# Altium project fast-open-switch r1.0.PrjPcb (part 4 of 8)

## Sheet Raspberry Pi CM4.SchDoc
size A3; SheetNumber: 7; SheetTotal: 22
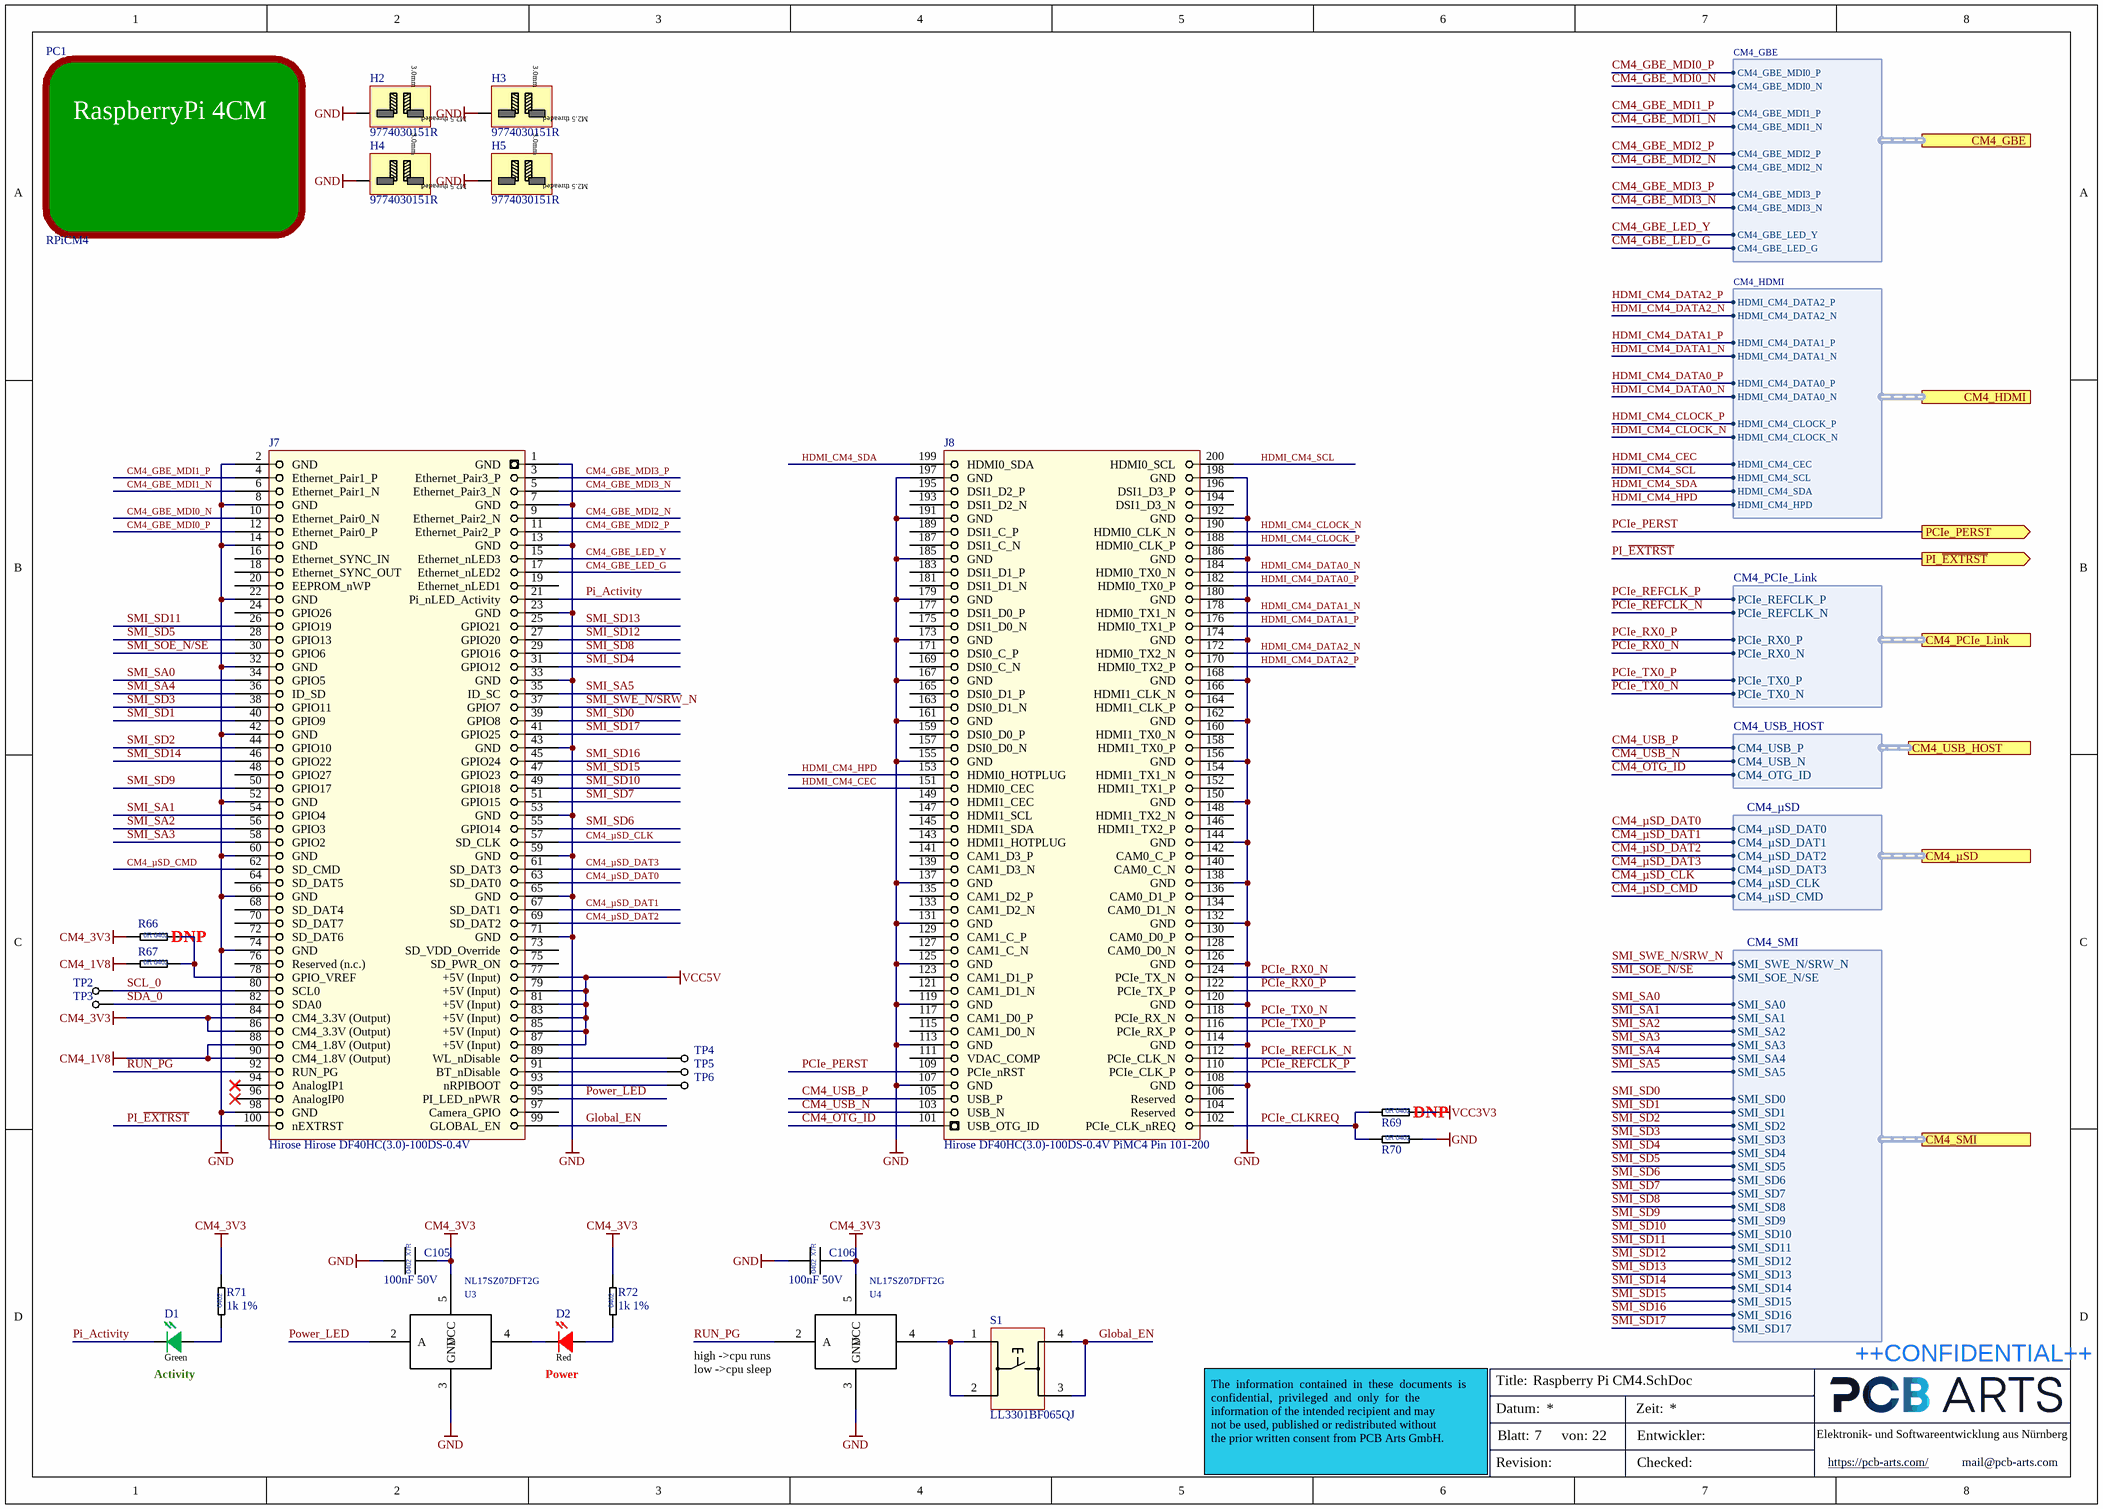
[diagram p9: Raspberry Pi CM4.SchDoc]

### Parts
C105  100nF 50V  [CAP_0402_L]
C106  100nF 50V  [CAP_0402_L]
D1  Color: Green  [LED-0603 Sideview]  (hidden comment: LTST-S270KGKT)
D2  Color: Red  [LED-0603 Sideview]  (hidden comment: LTST-S270KRKT)
H2  9774030151R  [9774030151R]
H3  9774030151R  [9774030151R]
H4  9774030151R  [9774030151R]
H5  9774030151R  [9774030151R]
J7  Hirose Hirose DF40HC(3.0)-100DS-0.4V  [Hirose DF40HC(3.0)-100DS-0.4V_1-100]
J8  Hirose DF40HC(3.0)-100DS-0.4V PiMC4 Pin 101-200  [Hirose DF40HC(3.0)-100DS-0.4V_101-200]
PC1  RPiCM4  [RaspberryPi_CM4]
R66  0R Jumper  [RES_0402_L]  (value not drawn)  (no BOM)
R67  0R Jumper  [RES_0402_L]  (value not drawn)
R69  0R Jumper  [RES_0402_L]  (value not drawn)  (no BOM)
R70  0R Jumper  [RES_0402_L]  (value not drawn)
R71  1k 1%  [RES_0402_L]
R72  1k 1%  [RES_0402_L]
S1  LL3301BF065QJ  [LL3301BF065QJ]
TP2  Testpoint  [Testpoint 0.8mm]  (value not drawn)  (no BOM)
TP3  Testpoint  [Testpoint 0.8mm]  (value not drawn)  (no BOM)
TP4  Testpoint  [Testpoint 0.8mm]  (value not drawn)  (no BOM)
TP5  Testpoint  [Testpoint 0.8mm]  (value not drawn)  (no BOM)
TP6  Testpoint  [Testpoint 0.8mm]  (value not drawn)  (no BOM)
U3  NL17SZ07DFT2G  [SOT65P210X110-5N]
U4  NL17SZ07DFT2G  [SOT65P210X110-5N]

### Ports
CM4_GBE (harness CM4_GBE, see Top-Level-Sheet[4C], Raspberry Pi CM4_Periphery[1A]), CM4_HDMI (harness CM4_HDMI, see Top-Level-Sheet[4C], Raspberry Pi CM4_Periphery[1C]), CM4_PCIe_Link (harness CM4_PCIe_Link, see Top-Level-Sheet[5C], MGT Banks 115-116[8B]), CM4_SMI (harness CM4_SMI, see Top-Level-Sheet[4C], SMI Bank 12[1A]), CM4_USB_HOST (harness CM4_USB_HOST, see Top-Level-Sheet[4C], USB-HUB-MUX[1A]), CM4_µSD (harness CM4_µSD, see Top-Level-Sheet[4C], Raspberry Pi CM4_Periphery[1D]), PCIe_PERST (out, see Top-Level-Sheet[5C], Bank 13_Bank 15_Bank 16[8A]), PI_~{EXTRST} (out, see Top-Level-Sheet[5C], Bank 13_Bank 15_Bank 16[8A])

### Harnesses
CM4_GBE: CM4_GBE_MDI0_P, CM4_GBE_MDI0_N, CM4_GBE_MDI1_P, CM4_GBE_MDI1_N, CM4_GBE_MDI2_P, CM4_GBE_MDI2_N, CM4_GBE_MDI3_P, CM4_GBE_MDI3_N, CM4_GBE_LED_Y, CM4_GBE_LED_G
CM4_HDMI: HDMI_CM4_DATA2_P, HDMI_CM4_DATA2_N, HDMI_CM4_DATA1_P, HDMI_CM4_DATA1_N, HDMI_CM4_DATA0_P, HDMI_CM4_DATA0_N, HDMI_CM4_CLOCK_P, HDMI_CM4_CLOCK_N, HDMI_CM4_CEC, HDMI_CM4_SCL, HDMI_CM4_SDA, HDMI_CM4_HPD
CM4_PCIe_Link: PCIe_REFCLK_P, PCIe_REFCLK_N, PCIe_RX0_P, PCIe_RX0_N, PCIe_TX0_P, PCIe_TX0_N
CM4_USB_HOST: CM4_USB_P, CM4_USB_N, CM4_OTG_ID
CM4_µSD: CM4_µSD_DAT1, CM4_µSD_DAT2, CM4_µSD_DAT3, CM4_µSD_CLK, CM4_µSD_DAT0, CM4_µSD_CMD
CM4_SMI: SMI_SOE_N/SE, SMI_SA0, SMI_SD0, SMI_SWE_N/SRW_N, SMI_SA1, SMI_SA2, SMI_SA3, SMI_SA4, SMI_SA5, SMI_SD1, SMI_SD2, SMI_SD3, SMI_SD4, SMI_SD5, SMI_SD6, SMI_SD7, SMI_SD8, SMI_SD9, SMI_SD10, SMI_SD11, SMI_SD12, SMI_SD13, SMI_SD14, SMI_SD15, SMI_SD16, SMI_SD17

### Nets
CM4_1V8: J7.88(CM4_1.8V_(Output)) J7.90(CM4_1.8V_(Output)) R67.1
CM4_3V3: C105.2 C106.2 J7.84(CM4_3.3V_(Output)) J7.86(CM4_3.3V_(Output)) R66.1 R71.2 R72.2 U3.5(VCC) U4.5(VCC)
GND: C105.1 C106.1 H2.1 H3.1 H4.1 H5.1 J7.1(GND) J7.2(GND) J7.7(GND) J7.8(GND) J7.13(GND) J7.14(GND) J7.22(GND) J7.23(GND) J7.32(GND) J7.33(GND) J7.42(GND) J7.43(GND) J7.52(GND) J7.53(GND) J7.59(GND) J7.60(GND) J7.65(GND) J7.66(GND) J7.71(GND) J7.74(GND) J7.98(GND) J8.107(GND) J8.108(GND) J8.113(GND) J8.114(GND) J8.119(GND) J8.120(GND) J8.125(GND) J8.126(GND) J8.131(GND) J8.132(GND) J8.137(GND) J8.138(GND) J8.144(GND) J8.150(GND) J8.155(GND) J8.156(GND) J8.161(GND) J8.162(GND) J8.167(GND) J8.168(GND) J8.173(GND) J8.174(GND) J8.179(GND) J8.180(GND) J8.185(GND) J8.186(GND) J8.191(GND) J8.192(GND) J8.197(GND) J8.198(GND) R70.2 U3.3(GND) U4.3(GND)
VCC3V3: R69.2
VCC5V: J7.77(+5V_(Input)) J7.79(+5V_(Input)) J7.81(+5V_(Input)) J7.83(+5V_(Input)) J7.85(+5V_(Input)) J7.87(+5V_(Input))
CM4_GBE_LED_G: J7.17(Ethernet_nLED2) ; port CM4_GBE.CM4_GBE_LED_G
CM4_GBE_LED_Y: J7.15(Ethernet_nLED3) ; port CM4_GBE.CM4_GBE_LED_Y
CM4_GBE_MDI0_N: J7.10(Ethernet_Pair0_N) ; port CM4_GBE.CM4_GBE_MDI0_N
CM4_GBE_MDI0_P: J7.12(Ethernet_Pair0_P) ; port CM4_GBE.CM4_GBE_MDI0_P
CM4_GBE_MDI1_N: J7.6(Ethernet_Pair1_N) ; port CM4_GBE.CM4_GBE_MDI1_N
CM4_GBE_MDI1_P: J7.4(Ethernet_Pair1_P) ; port CM4_GBE.CM4_GBE_MDI1_P
CM4_GBE_MDI2_N: J7.9(Ethernet_Pair2_N) ; port CM4_GBE.CM4_GBE_MDI2_N
CM4_GBE_MDI2_P: J7.11(Ethernet_Pair2_P) ; port CM4_GBE.CM4_GBE_MDI2_P
CM4_GBE_MDI3_N: J7.5(Ethernet_Pair3_N) ; port CM4_GBE.CM4_GBE_MDI3_N
CM4_GBE_MDI3_P: J7.3(Ethernet_Pair3_P) ; port CM4_GBE.CM4_GBE_MDI3_P
CM4_OTG_ID: J8.101(USB_OTG_ID) ; port CM4_USB_HOST.CM4_OTG_ID
CM4_USB_N: J8.103(USB_N) ; port CM4_USB_HOST.CM4_USB_N
CM4_USB_P: J8.105(USB_P) ; port CM4_USB_HOST.CM4_USB_P
CM4_µSD_CLK: J7.57(SD_CLK) ; port CM4_µSD.CM4_µSD_CLK
CM4_µSD_CMD: J7.62(SD_CMD) ; port CM4_µSD.CM4_µSD_CMD
CM4_µSD_DAT0: J7.63(SD_DAT0) ; port CM4_µSD.CM4_µSD_DAT0
CM4_µSD_DAT1: J7.67(SD_DAT1) ; port CM4_µSD.CM4_µSD_DAT1
CM4_µSD_DAT2: J7.69(SD_DAT2) ; port CM4_µSD.CM4_µSD_DAT2
CM4_µSD_DAT3: J7.61(SD_DAT3) ; port CM4_µSD.CM4_µSD_DAT3
Global_EN: J7.99(GLOBAL_EN) S1.3 S1.4
HDMI_CM4_CEC: J8.151(HDMI0_CEC) ; port CM4_HDMI.HDMI_CM4_CEC
HDMI_CM4_CLOCK_N: J8.190(HDMI0_CLK_N) ; port CM4_HDMI.HDMI_CM4_CLOCK_N
HDMI_CM4_CLOCK_P: J8.188(HDMI0_CLK_P) ; port CM4_HDMI.HDMI_CM4_CLOCK_P
HDMI_CM4_DATA0_N: J8.184(HDMI0_TX0_N) ; port CM4_HDMI.HDMI_CM4_DATA0_N
HDMI_CM4_DATA0_P: J8.182(HDMI0_TX0_P) ; port CM4_HDMI.HDMI_CM4_DATA0_P
HDMI_CM4_DATA1_N: J8.178(HDMI0_TX1_N) ; port CM4_HDMI.HDMI_CM4_DATA1_N
HDMI_CM4_DATA1_P: J8.176(HDMI0_TX1_P) ; port CM4_HDMI.HDMI_CM4_DATA1_P
HDMI_CM4_DATA2_N: J8.172(HDMI0_TX2_N) ; port CM4_HDMI.HDMI_CM4_DATA2_N
HDMI_CM4_DATA2_P: J8.170(HDMI0_TX2_P) ; port CM4_HDMI.HDMI_CM4_DATA2_P
HDMI_CM4_HPD: J8.153(HDMI0_HOTPLUG) ; port CM4_HDMI.HDMI_CM4_HPD
HDMI_CM4_SCL: J8.200(HDMI0_SCL) ; port CM4_HDMI.HDMI_CM4_SCL
HDMI_CM4_SDA: J8.199(HDMI0_SDA) ; port CM4_HDMI.HDMI_CM4_SDA
PCIe_CLKREQ: J8.102(PCIe_CLK_nREQ) R69.1 R70.1
PCIe_PERST: J8.109(PCIe_nRST) ; port PCIe_PERST
PCIe_REFCLK_N: J8.112(PCIe_CLK_N) ; port CM4_PCIe_Link.PCIe_REFCLK_N
PCIe_REFCLK_P: J8.110(PCIe_CLK_P) ; port CM4_PCIe_Link.PCIe_REFCLK_P
PCIe_RX0_N: J8.124(PCIe_TX_N) ; port CM4_PCIe_Link.PCIe_RX0_N
PCIe_RX0_P: J8.122(PCIe_TX_P) ; port CM4_PCIe_Link.PCIe_RX0_P
PCIe_TX0_N: J8.118(PCIe_RX_N) ; port CM4_PCIe_Link.PCIe_TX0_N
PCIe_TX0_P: J8.116(PCIe_RX_P) ; port CM4_PCIe_Link.PCIe_TX0_P
Pi_Activity: D1.1 J7.21(Pi_nLED_Activity)
PI_~{EXTRST}: J7.100(nEXTRST) ; port PI_~{EXTRST}
Power_LED: J7.95(PI_LED_nPWR) U3.2(A)
RUN_PG: J7.92(RUN_PG) U4.2(A)
SCL_0: J7.80(SCL0) TP2.1(GND)
SDA_0: J7.82(SDA0) TP3.1(GND)
SMI_SA0: J7.34(GPIO5) ; port CM4_SMI.SMI_SA0
SMI_SA1: J7.54(GPIO4) ; port CM4_SMI.SMI_SA1
SMI_SA2: J7.56(GPIO3) ; port CM4_SMI.SMI_SA2
SMI_SA3: J7.58(GPIO2) ; port CM4_SMI.SMI_SA3
SMI_SA4: J7.36(ID_SD) ; port CM4_SMI.SMI_SA4
SMI_SA5: J7.35(ID_SC) ; port CM4_SMI.SMI_SA5
SMI_SD0: J7.39(GPIO8) ; port CM4_SMI.SMI_SD0
SMI_SD1: J7.40(GPIO9) ; port CM4_SMI.SMI_SD1
SMI_SD2: J7.44(GPIO10) ; port CM4_SMI.SMI_SD2
SMI_SD3: J7.38(GPIO11) ; port CM4_SMI.SMI_SD3
SMI_SD4: J7.31(GPIO12) ; port CM4_SMI.SMI_SD4
SMI_SD5: J7.28(GPIO13) ; port CM4_SMI.SMI_SD5
SMI_SD6: J7.55(GPIO14) ; port CM4_SMI.SMI_SD6
SMI_SD7: J7.51(GPIO15) ; port CM4_SMI.SMI_SD7
SMI_SD8: J7.29(GPIO16) ; port CM4_SMI.SMI_SD8
SMI_SD9: J7.50(GPIO17) ; port CM4_SMI.SMI_SD9
SMI_SD10: J7.49(GPIO18) ; port CM4_SMI.SMI_SD10
SMI_SD11: J7.26(GPIO19) ; port CM4_SMI.SMI_SD11
SMI_SD12: J7.27(GPIO20) ; port CM4_SMI.SMI_SD12
SMI_SD13: J7.25(GPIO21) ; port CM4_SMI.SMI_SD13
SMI_SD14: J7.46(GPIO22) ; port CM4_SMI.SMI_SD14
SMI_SD15: J7.47(GPIO23) ; port CM4_SMI.SMI_SD15
SMI_SD16: J7.45(GPIO24) ; port CM4_SMI.SMI_SD16
SMI_SD17: J7.41(GPIO25) ; port CM4_SMI.SMI_SD17
SMI_SOE_N/SE: J7.30(GPIO6) ; port CM4_SMI.SMI_SOE_N/SE
SMI_SWE_N/SRW_N: J7.37(GPIO7) ; port CM4_SMI.SMI_SWE_N/SRW_N
NetD1_2: D1.2 R71.1
NetD2_1: D2.1 U3.4(Y)
NetD2_2: D2.2 R72.1
NetJ7_78: J7.78(GPIO_VREF) R66.2 R67.2
NetJ7_89: J7.89(WL_nDisable) TP4.1(GND)
NetJ7_91: J7.91(BT_nDisable) TP5.1(GND)
NetJ7_93: J7.93(nRPIBOOT) TP6.1(GND)
NetS1_1: S1.1 S1.2 U4.4(Y)

Not connected (* = marked no-connect by the designer): J7 16(Ethernet_SYNC_IN) 18(Ethernet_SYNC_OUT) 19(Ethernet_nLED1) 20(EEPROM_nWP) 24(GPIO26) 48(GPIO27) 64(SD_DAT5) 68(SD_DAT4) 70(SD_DAT7) 72(SD_DAT6) 73(SD_VDD_Override) 75(SD_PWR_ON) 76(Reserved_(n.c.)) 94(AnalogIP1)* 96(AnalogIP0)* 97(Camera_GPIO); J8 104(Reserved) 106(Reserved) 111(VDAC_COMP) 115(CAM1_D0_N) 117(CAM1_D0_P) 121(CAM1_D1_N) 123(CAM1_D1_P) 127(CAM1_C_N) 128(CAM0_D0_N) 129(CAM1_C_P) 130(CAM0_D0_P) 133(CAM1_D2_N) 134(CAM0_D1_N) 135(CAM1_D2_P) 136(CAM0_D1_P) 139(CAM1_D3_N) 140(CAM0_C_N) 141(CAM1_D3_P) 142(CAM0_C_P) 143(HDMI1_HOTPLUG) 145(HDMI1_SDA) 146(HDMI1_TX2_P) 147(HDMI1_SCL) 148(HDMI1_TX2_N) 149(HDMI1_CEC) 152(HDMI1_TX1_P) 154(HDMI1_TX1_N) 157(DSI0_D0_N) 158(HDMI1_TX0_P) 159(DSI0_D0_P) 160(HDMI1_TX0_N) 163(DSI0_D1_N) 164(HDMI1_CLK_P) 165(DSI0_D1_P) 166(HDMI1_CLK_N) 169(DSI0_C_N) 171(DSI0_C_P) 175(DSI1_D0_N) 177(DSI1_D0_P) 181(DSI1_D1_N) 183(DSI1_D1_P) 187(DSI1_C_N) 189(DSI1_C_P) 193(DSI1_D2_N) 194(DSI1_D3_N) 195(DSI1_D2_P) 196(DSI1_D3_P)

### Notes on the sheet
- (near R66) DNP
- (near R69) DNP
- (near D1) Activity
- (near D2) Power
- (near U4) high ->cpu runs
- (near U4) low ->cpu sleep
- Title:
- ++CONFIDENTIAL++
- Datum:
- Blatt:
- von:
- Zeit:
- Entwickler:
- Elektronik- und Softwareentwicklung aus Nürnberg
- The  information  contained  in  these  documents  is  confidential,  privileged  and  only  for  the
  information of the intended recipient and may
  not be used, published or redistributed without
  the prior written consent from PCB Arts GmbH.
- Revision:
- Checked:
- https://pcb-arts.com/
- mail@pcb-arts.com
- (in symbol CAP_0402_100nF_50V) X7R; 0402
- (in symbol Raspberry Pi Compute Module 4) RaspberryPi 4CM
- (in symbol RES_0402_0R Jumper) 0R 0402
- (in symbol RES_0402_1k_1%) 0402
- (in symbol Würth Standoff M2.5 h:3.0mm) 3.0mm; M2.5 threaded

### Library data of the parts
C105 C106 = CAP_0402_100nF_50V: Multilayer Ceramic Capacitors MLCC - SMD/SMT 0402 50VDC; Manufacturer 1: Murata Electronics; Manufacturer 1 Prt. Nr.: GCM155L8EH104KE07D; Manufacturer 2 Prt. Nr.: UMK105B7104KV-FR; Manufacturer 2: TDK
D1 = LED 0603 Green Sideview: GREEN  0603 Light Emitting Diode; Manufacturer 1: lite-On; Manufacturer 1 Prt. Nr.: LTST-S270KGKT
D2 = LED 0603 Red Sideview: RED  0603 Light Emitting Diode; Manufacturer 1: lite-On; Manufacturer 1 Prt. Nr.: LTST-S270KRKT
H2-H5 = Würth Standoff M2.5 h:3.0mm: Würth Standoff M2.5 h:3.0mm 9774030151R; Manufacturer 1: Würth Elektronik; Manufacturer 1 Prt. Nr.: 9774030151R
J7 = DF40HC(3.0)-100DS-0.4V RPiCM4 Pin 1-100: Hirose DF40HC(3.0)-100DS-0.4V 3mm heigth receptacle for Raspberry Pi CM4, Pin 1-100; Manufacturer 1: Hirose; Manufacturer Prt. Nr.: DF40HC(3.0)-100DS-0.4V
J8 = DF40HC(3.0)-100DS-0.4V RPiCM4 Pin 101-200: Hirose DF40C-100DS-0.4V 3mm heigth receptacle for Raspberry Pi CM4, Pin 101-200; Manufacturer 1: Hirose; Manufacturer 1 Prt. Nr.: DF40HC(3.0)-100DS-0.4V
PC1 = Raspberry Pi Compute Module 4: Raspberry Pi 4 Compute Module 4; Manufacturer 1: Raspberry Pi; Manufacturer 1 Prt. Nr.: Compute Module 4
R66 R67 R69 R70 = RES_0402_0R Jumper: Thick Film Resistors - SMD 0Ohm; Manufacturer 1: Vishay / Dale; Manufacturer 1 Prt. Nr.: CRCW04020000Z0EDC; Manufacturer 2 Prt. Nr.: RC0402JR-070RL; Manufacturer 2: Yageo
R71 R72 = RES_0402_1k_1%: Thick Film Resistors - SMD 1kOhm 1%; Manufacturer 1: Vishay / Dale; Manufacturer 1 Prt. Nr.: CRCW04021K00FKEDC; Manufacturer 2 Prt. Nr.: RC0402FR-7W1KL; Manufacturer 2: Yageo
S1 = LL3301BF065QJ_SPST Top Actuated  Button, 65gf, SMD h: 9.8mm: SPST Top Actuated  Button, 65gf, SMD h: 9.8mm; Manufacturer 1: E-Switch; Manufacturer 1 Prt. Nr.: LL3301BF065QJ
TP2-TP6 = Testpoint 0.8mm
U3 U4 = NL17SZ07DFT2G_Buffer 1.65-5.5V Single Non-Inverting: Puffer u. Leitungstreiber 1.65-5.5V Single Non-Inverting; Manufacturer 1: ON Semiconductor; Manufacturer 1 Prt. Nr.: NL17SZ07DFT2G

## Sheet SFP+_Connectors.SchDoc
size A3; SheetNumber: 5; SheetTotal: 22
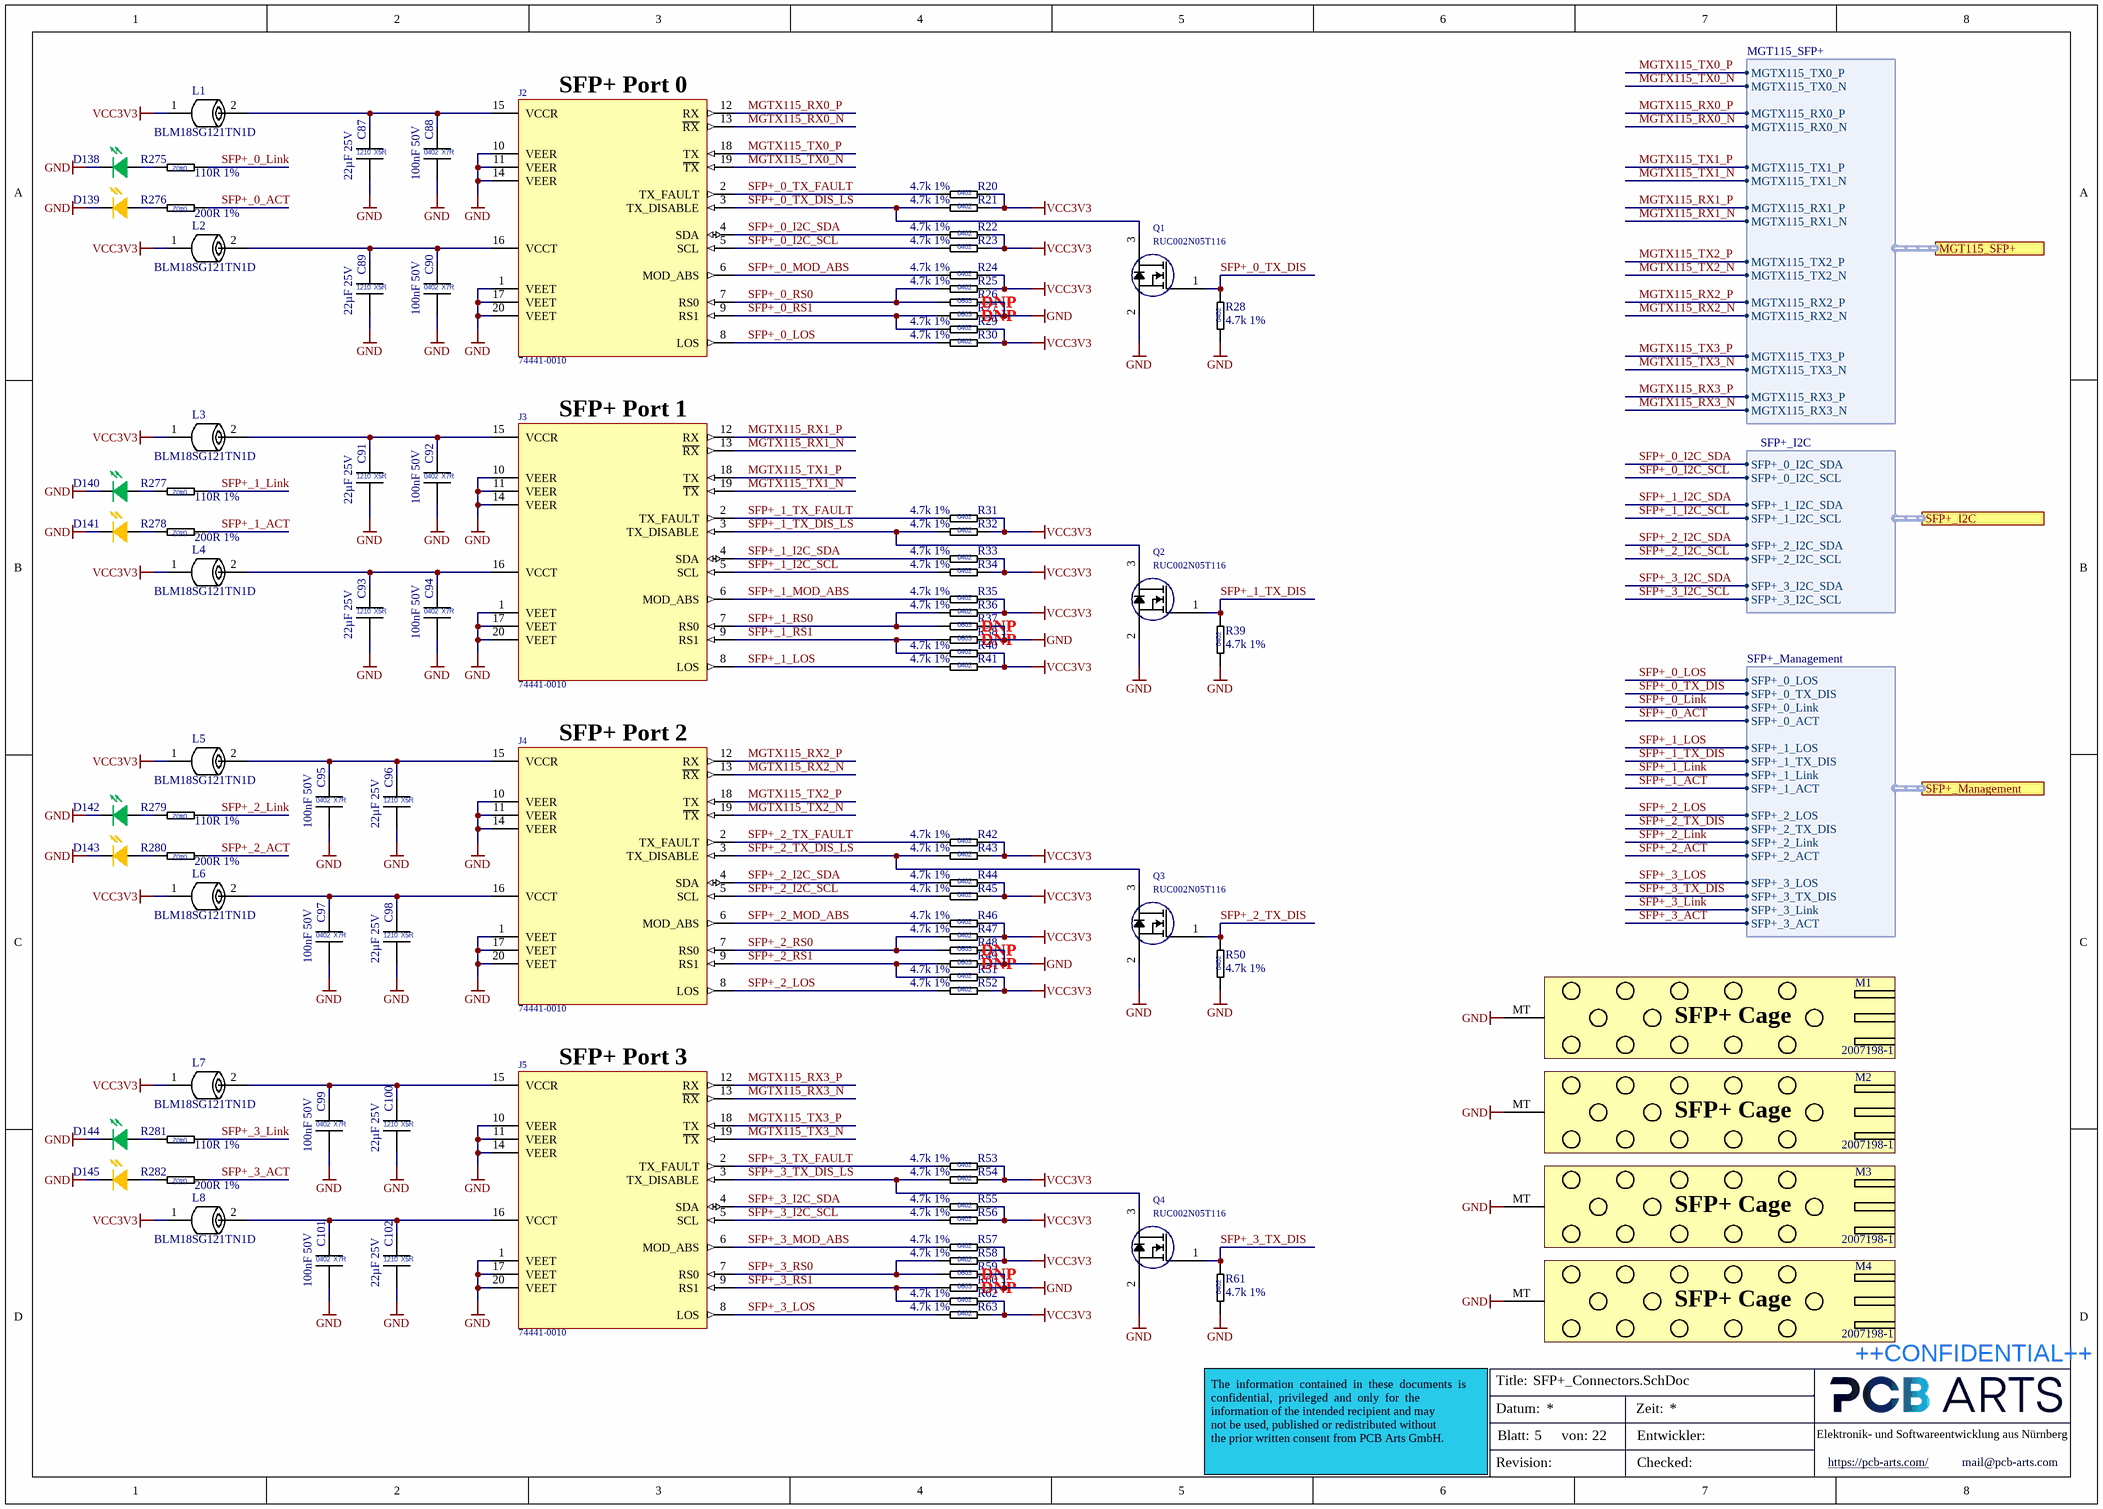
[diagram p10: SFP+_Connectors.SchDoc]

### Parts
C87  22µF 25V  [CAP_1210]
C88  100nF 50V  [CAP_0402_L]
C89  22µF 25V  [CAP_1210]
C90  100nF 50V  [CAP_0402_L]
C91  22µF 25V  [CAP_1210]
C92  100nF 50V  [CAP_0402_L]
C93  22µF 25V  [CAP_1210]
C94  100nF 50V  [CAP_0402_L]
C95  100nF 50V  [CAP_0402_L]
C96  22µF 25V  [CAP_1210]
C97  100nF 50V  [CAP_0402_L]
C98  22µF 25V  [CAP_1210]
C99  100nF 50V  [CAP_0402_L]
C100  22µF 25V  [CAP_1210]
C101  100nF 50V  [CAP_0402_L]
C102  22µF 25V  [CAP_1210]
D138  LTST-S270KGKT  [LED-0603 Sideview]  (value not drawn)
D139  LTST-S270KFKT  [LED-0603 Sideview]  (value not drawn)
D140  LTST-S270KGKT  [LED-0603 Sideview]  (value not drawn)
D141  LTST-S270KFKT  [LED-0603 Sideview]  (value not drawn)
D142  LTST-S270KGKT  [LED-0603 Sideview]  (value not drawn)
D143  LTST-S270KFKT  [LED-0603 Sideview]  (value not drawn)
D144  LTST-S270KGKT  [LED-0603 Sideview]  (value not drawn)
D145  LTST-S270KFKT  [LED-0603 Sideview]  (value not drawn)
J2  74441-0010  [74441-0010]
J3  74441-0010  [74441-0010]
J4  74441-0010  [74441-0010]
J5  74441-0010  [74441-0010]
L1  BLM18SG121TN1D  [L_0603]
L2  BLM18SG121TN1D  [L_0603]
L3  BLM18SG121TN1D  [L_0603]
L4  BLM18SG121TN1D  [L_0603]
L5  BLM18SG121TN1D  [L_0603]
L6  BLM18SG121TN1D  [L_0603]
L7  BLM18SG121TN1D  [L_0603]
L8  BLM18SG121TN1D  [L_0603]
M1  2007198-1  [2007198-1]
M2  2007198-1  [2007198-1]
M3  2007198-1  [2007198-1]
M4  2007198-1  [2007198-1]
Q1  RUC002N05T116  [SOT95P251X112-3N]
Q2  RUC002N05T116  [SOT95P251X112-3N]
Q3  RUC002N05T116  [SOT95P251X112-3N]
Q4  RUC002N05T116  [SOT95P251X112-3N]
R20  4.7k 1%  [RES_0402_L]
R21  4.7k 1%  [RES_0402_L]
R22  4.7k 1%  [RES_0402_L]
R23  4.7k 1%  [RES_0402_L]
R24  4.7k 1%  [RES_0402_L]
R25  4.7k 1%  [RES_0402_L]
R26  0R Jumper  [RES_0603_L]  (value not drawn)  (no BOM)
R27  0R Jumper  [RES_0603_L]  (value not drawn)  (no BOM)
R28  4.7k 1%  [RES_0402_L]
R29  4.7k 1%  [RES_0402_L]
R30  4.7k 1%  [RES_0402_L]
R31  4.7k 1%  [RES_0402_L]
R32  4.7k 1%  [RES_0402_L]
R33  4.7k 1%  [RES_0402_L]
R34  4.7k 1%  [RES_0402_L]
R35  4.7k 1%  [RES_0402_L]
R36  4.7k 1%  [RES_0402_L]
R37  0R Jumper  [RES_0603_L]  (value not drawn)  (no BOM)
R38  0R Jumper  [RES_0603_L]  (value not drawn)  (no BOM)
R39  4.7k 1%  [RES_0402_L]
R40  4.7k 1%  [RES_0402_L]
R41  4.7k 1%  [RES_0402_L]
R42  4.7k 1%  [RES_0402_L]
R43  4.7k 1%  [RES_0402_L]
R44  4.7k 1%  [RES_0402_L]
R45  4.7k 1%  [RES_0402_L]
R46  4.7k 1%  [RES_0402_L]
R47  4.7k 1%  [RES_0402_L]
R48  0R Jumper  [RES_0603_L]  (value not drawn)  (no BOM)
R49  0R Jumper  [RES_0603_L]  (value not drawn)  (no BOM)
R50  4.7k 1%  [RES_0402_L]
R51  4.7k 1%  [RES_0402_L]
R52  4.7k 1%  [RES_0402_L]
R53  4.7k 1%  [RES_0402_L]
R54  4.7k 1%  [RES_0402_L]
R55  4.7k 1%  [RES_0402_L]
R56  4.7k 1%  [RES_0402_L]
R57  4.7k 1%  [RES_0402_L]
R58  4.7k 1%  [RES_0402_L]
R59  0R Jumper  [RES_0603_L]  (value not drawn)  (no BOM)
R60  0R Jumper  [RES_0603_L]  (value not drawn)  (no BOM)
R61  4.7k 1%  [RES_0402_L]
R62  4.7k 1%  [RES_0402_L]
R63  4.7k 1%  [RES_0402_L]
R275  110R 1%  [RES_0402_L]
R276  200R 1%  [RES_0402_L]
R277  110R 1%  [RES_0402_L]
R278  200R 1%  [RES_0402_L]
R279  110R 1%  [RES_0402_L]
R280  200R 1%  [RES_0402_L]
R281  110R 1%  [RES_0402_L]
R282  200R 1%  [RES_0402_L]

### Ports
MGT115_SFP+ (harness MGT115_SFP+, see Top-Level-Sheet[6B], MGT Banks 115-116[8A]), SFP+_I2C (harness SFP+_I2C, see Top-Level-Sheet[6B], I2C Multiplexer[7A]), SFP+_Management (harness SFP+_Management, see Top-Level-Sheet[6B], Bank 13_Bank 15_Bank 16[8D])

### Harnesses
MGT115_SFP+: MGTX115_TX0_P, MGTX115_TX0_N, MGTX115_RX0_P, MGTX115_RX0_N, MGTX115_TX1_P, MGTX115_TX1_N, MGTX115_RX1_P, MGTX115_RX1_N, MGTX115_TX2_P, MGTX115_TX2_N, MGTX115_RX2_P, MGTX115_RX2_N, MGTX115_TX3_P, MGTX115_TX3_N, MGTX115_RX3_P, MGTX115_RX3_N
SFP+_I2C: SFP+_3_I2C_SDA, SFP+_3_I2C_SCL, SFP+_0_I2C_SDA, SFP+_0_I2C_SCL, SFP+_1_I2C_SDA, SFP+_1_I2C_SCL, SFP+_2_I2C_SDA, SFP+_2_I2C_SCL
SFP+_Management: SFP+_0_LOS, SFP+_0_TX_DIS, SFP+_0_Link, SFP+_0_ACT, SFP+_1_LOS, SFP+_1_TX_DIS, SFP+_1_Link, SFP+_1_ACT, SFP+_2_LOS, SFP+_2_TX_DIS, SFP+_2_Link, SFP+_2_ACT, SFP+_3_LOS, SFP+_3_TX_DIS, SFP+_3_Link, SFP+_3_ACT

### Nets
GND: C87.2 C88.2 C89.2 C90.2 C91.2 C92.2 C93.2 C94.2 C95.2 C96.2 C97.2 C98.2 C99.2 C100.2 C101.2 C102.2 D138.1 D139.1 D140.1 D141.1 D142.1 D143.1 D144.1 D145.1 J2.1(VEET) J2.10(VEER) J2.11(VEER) J2.14(VEER) J2.17(VEET) J2.20(VEET) J3.1(VEET) J3.10(VEER) J3.11(VEER) J3.14(VEER) J3.17(VEET) J3.20(VEET) J4.1(VEET) J4.10(VEER) J4.11(VEER) J4.14(VEER) J4.17(VEET) J4.20(VEET) J5.1(VEET) J5.10(VEER) J5.11(VEER) J5.14(VEER) J5.17(VEET) J5.20(VEET) M1.MT M2.MT M3.MT M4.MT Q1.2(D) Q2.2(D) Q3.2(D) Q4.2(D) R26.2 R27.2 R28.1 R37.2 R38.2 R39.1 R48.2 R49.2 R50.1 R59.2 R60.2 R61.1
VCC3V3: L1.1 L2.1 L3.1 L4.1 L5.1 L6.1 L7.1 L8.1 R20.2 R21.2 R22.2 R23.2 R24.2 R25.2 R29.2 R30.2 R31.2 R32.2 R33.2 R34.2 R35.2 R36.2 R40.2 R41.2 R42.2 R43.2 R44.2 R45.2 R46.2 R47.2 R51.2 R52.2 R53.2 R54.2 R55.2 R56.2 R57.2 R58.2 R62.2 R63.2
MGTX115_RX0_N: J2.13(~{RX}) ; port MGT115_SFP+.MGTX115_RX0_N
MGTX115_RX0_P: J2.12(RX) ; port MGT115_SFP+.MGTX115_RX0_P
MGTX115_RX1_N: J3.13(~{RX}) ; port MGT115_SFP+.MGTX115_RX1_N
MGTX115_RX1_P: J3.12(RX) ; port MGT115_SFP+.MGTX115_RX1_P
MGTX115_RX2_N: J4.13(~{RX}) ; port MGT115_SFP+.MGTX115_RX2_N
MGTX115_RX2_P: J4.12(RX) ; port MGT115_SFP+.MGTX115_RX2_P
MGTX115_RX3_N: J5.13(~{RX}) ; port MGT115_SFP+.MGTX115_RX3_N
MGTX115_RX3_P: J5.12(RX) ; port MGT115_SFP+.MGTX115_RX3_P
MGTX115_TX0_N: J2.19(~{TX}) ; port MGT115_SFP+.MGTX115_TX0_N
MGTX115_TX0_P: J2.18(TX) ; port MGT115_SFP+.MGTX115_TX0_P
MGTX115_TX1_N: J3.19(~{TX}) ; port MGT115_SFP+.MGTX115_TX1_N
MGTX115_TX1_P: J3.18(TX) ; port MGT115_SFP+.MGTX115_TX1_P
MGTX115_TX2_N: J4.19(~{TX}) ; port MGT115_SFP+.MGTX115_TX2_N
MGTX115_TX2_P: J4.18(TX) ; port MGT115_SFP+.MGTX115_TX2_P
MGTX115_TX3_N: J5.19(~{TX}) ; port MGT115_SFP+.MGTX115_TX3_N
MGTX115_TX3_P: J5.18(TX) ; port MGT115_SFP+.MGTX115_TX3_P
SFP+_0_ACT: R276.1 ; port SFP+_Management.SFP+_0_ACT
SFP+_0_I2C_SCL: J2.5(SCL) R23.1 ; port SFP+_I2C.SFP+_0_I2C_SCL
SFP+_0_I2C_SDA: J2.4(SDA) R22.1 ; port SFP+_I2C.SFP+_0_I2C_SDA
SFP+_0_Link: R275.1 ; port SFP+_Management.SFP+_0_Link
SFP+_0_LOS: J2.8(LOS) R30.1 ; port SFP+_Management.SFP+_0_LOS
SFP+_0_MOD_ABS: J2.6(MOD_ABS) R24.1
SFP+_0_RS0: J2.7(RS0) R25.1 R26.1
SFP+_0_RS1: J2.9(RS1) R27.1 R29.1
SFP+_0_TX_DIS: Q1.1(G) R28.2 ; port SFP+_Management.SFP+_0_TX_DIS
SFP+_0_TX_DIS_LS: J2.3(TX_DISABLE) Q1.3(S) R21.1
SFP+_0_TX_FAULT: J2.2(TX_FAULT) R20.1
SFP+_1_ACT: R278.1 ; port SFP+_Management.SFP+_1_ACT
SFP+_1_I2C_SCL: J3.5(SCL) R34.1 ; port SFP+_I2C.SFP+_1_I2C_SCL
SFP+_1_I2C_SDA: J3.4(SDA) R33.1 ; port SFP+_I2C.SFP+_1_I2C_SDA
SFP+_1_Link: R277.1 ; port SFP+_Management.SFP+_1_Link
SFP+_1_LOS: J3.8(LOS) R41.1 ; port SFP+_Management.SFP+_1_LOS
SFP+_1_MOD_ABS: J3.6(MOD_ABS) R35.1
SFP+_1_RS0: J3.7(RS0) R36.1 R37.1
SFP+_1_RS1: J3.9(RS1) R38.1 R40.1
SFP+_1_TX_DIS: Q2.1(G) R39.2 ; port SFP+_Management.SFP+_1_TX_DIS
SFP+_1_TX_DIS_LS: J3.3(TX_DISABLE) Q2.3(S) R32.1
SFP+_1_TX_FAULT: J3.2(TX_FAULT) R31.1
SFP+_2_ACT: R280.1 ; port SFP+_Management.SFP+_2_ACT
SFP+_2_I2C_SCL: J4.5(SCL) R45.1 ; port SFP+_I2C.SFP+_2_I2C_SCL
SFP+_2_I2C_SDA: J4.4(SDA) R44.1 ; port SFP+_I2C.SFP+_2_I2C_SDA
SFP+_2_Link: R279.1 ; port SFP+_Management.SFP+_2_Link
SFP+_2_LOS: J4.8(LOS) R52.1 ; port SFP+_Management.SFP+_2_LOS
SFP+_2_MOD_ABS: J4.6(MOD_ABS) R46.1
SFP+_2_RS0: J4.7(RS0) R47.1 R48.1
SFP+_2_RS1: J4.9(RS1) R49.1 R51.1
SFP+_2_TX_DIS: Q3.1(G) R50.2 ; port SFP+_Management.SFP+_2_TX_DIS
SFP+_2_TX_DIS_LS: J4.3(TX_DISABLE) Q3.3(S) R43.1
SFP+_2_TX_FAULT: J4.2(TX_FAULT) R42.1
SFP+_3_ACT: R282.1 ; port SFP+_Management.SFP+_3_ACT
SFP+_3_I2C_SCL: J5.5(SCL) R56.1 ; port SFP+_I2C.SFP+_3_I2C_SCL
SFP+_3_I2C_SDA: J5.4(SDA) R55.1 ; port SFP+_I2C.SFP+_3_I2C_SDA
SFP+_3_Link: R281.1 ; port SFP+_Management.SFP+_3_Link
SFP+_3_LOS: J5.8(LOS) R63.1 ; port SFP+_Management.SFP+_3_LOS
SFP+_3_MOD_ABS: J5.6(MOD_ABS) R57.1
SFP+_3_RS0: J5.7(RS0) R58.1 R59.1
SFP+_3_RS1: J5.9(RS1) R60.1 R62.1
SFP+_3_TX_DIS: Q4.1(G) R61.2 ; port SFP+_Management.SFP+_3_TX_DIS
SFP+_3_TX_DIS_LS: J5.3(TX_DISABLE) Q4.3(S) R54.1
SFP+_3_TX_FAULT: J5.2(TX_FAULT) R53.1
NetC87_1: C87.1 C88.1 J2.15(VCCR) L1.2
NetC89_1: C89.1 C90.1 J2.16(VCCT) L2.2
NetC91_1: C91.1 C92.1 J3.15(VCCR) L3.2
NetC93_1: C93.1 C94.1 J3.16(VCCT) L4.2
NetC95_1: C95.1 C96.1 J4.15(VCCR) L5.2
NetC97_1: C97.1 C98.1 J4.16(VCCT) L6.2
NetC99_1: C99.1 C100.1 J5.15(VCCR) L7.2
NetC101_1: C101.1 C102.1 J5.16(VCCT) L8.2
NetD138_2: D138.2 R275.2
NetD139_2: D139.2 R276.2
NetD140_2: D140.2 R277.2
NetD141_2: D141.2 R278.2
NetD142_2: D142.2 R279.2
NetD143_2: D143.2 R280.2
NetD144_2: D144.2 R281.2
NetD145_2: D145.2 R282.2

### Notes on the sheet
- (near J2) SFP+ Port 0
- DNP
- (near J3) SFP+ Port 1
- (near J4) SFP+ Port 2
- (near J5) SFP+ Port 3
- Title:
- ++CONFIDENTIAL++
- Datum:
- Blatt:
- von:
- Zeit:
- Entwickler:
- Elektronik- und Softwareentwicklung aus Nürnberg
- The  information  contained  in  these  documents  is  confidential,  privileged  and  only  for  the
  information of the intended recipient and may
  not be used, published or redistributed without
  the prior written consent from PCB Arts GmbH.
- Revision:
- Checked:
- https://pcb-arts.com/
- mail@pcb-arts.com
- (in symbol 2007198-1_2SFP+ Cage, 1x1, external EMV springs, no lightpipes) SFP+ Cage
- (in symbol CAP_0402_100nF_50V) 0402; X7R
- (in symbol CAP_1210_22µF_25V) 1210; X5R
- (in symbol RES_0402_4.7k_1%) 0402
- (in symbol RES_0402_110R_1%) 0402
- (in symbol RES_0402_200R 1%) 0402
- (in symbol RES_0603_0R_Jumper) 0603

### Library data of the parts
C87 C89 C91 C93 C96 C98 C100 C102 = CAP_1210_22µF_25V: Multilayer Ceramic Capacitors MLCC - SMD/SMT 1210 25VDC; Manufacturer 1: KEMET; Manufacturer 1 Prt. Nr.: C1210C226K3PACTU; Manufacturer 2 Prt. Nr.: TMK212BBJ226MG-TT; Manufacturer 2: Taiyo Yuden
C88 C90 C92 C94 C95 C97 C99 C101 = CAP_0402_100nF_50V: as C105 on sheet Raspberry Pi CM4; Manufacturer 2: TDK
D138 D140 D142 D144 = LED 0603 Green Sideview: as D1 on sheet Raspberry Pi CM4; Manufacturer 1 Prt. Nr.: LTST-S270KGKT; Color: Green
D139 D141 D143 D145 = LED 0603 ORANGE Sideview: ORANGE 0603 Light Emitting Diode; Manufacturer 1: lite-On; Manufacturer 1 Prt. Nr.: LTST-S270KFKT; Color: Orange
J2-J5 = 74441-0010_Card Edge Connector for SFP+: 20 Pin Right Angle 0.8mm SMD Card Edge Connector for SFP+; Manufacturer 1: Molex; Manufacturer 1 Prt. Nr.: 74441-0010
L1-L8 = BLM18SG121TN1D_Ferrite Beads 0603 120Ohms 3000mA: Ferritperlen BLM18_xN 0603 100MHz 120Ohm 3000mA 25mOhm RSER; Manufacturer 1: Murata Electronics; Manufacturer 1 Prt. Nr.: BLM18SG121TN1D
M1-M4 = 2007198-1_2SFP+ Cage, 1x1, external EMV springs, no lightpipes: 2SFP+ Cage, 1x1, external EMV springs, no lightpipes; Manufacturer 1: TE Connectivity; Manufacturer 1 Prt. Nr.: 2007198-1
Q1-Q4 = RUC002N05T116_MOSFET N-Ch 1.2 VGS Spec: MOSFET N-Ch 1.2 VGS Spec; Manufacturer 1: ROHM Semiconductor; Manufacturer 1 Prt. Nr.: RUC002N05T116
R20-R25 R28-R36 R39-R47 R50-R58 R61-R63 = RES_0402_4.7k_1%: Thick Film Resistors - SMD 4.7kOhm 1%; Manufacturer 1: Vishay / Dale; Manufacturer 1 Prt. Nr.: CRCW04024K70FKEDC; Manufacturer 2 Prt. Nr.: RC0402FR-134K7L; Manufacturer 2: Yageo
R26 R27 R37 R38 R48 R49 R59 R60 = RES_0603_0R_Jumper: Thick Film Resistors - SMD 0Ohm Jumper; Manufacturer 1: Yageo; Manufacturer 1 Prt. Nr.: RC0603JR-100RL; Manufacturer 2 Prt. Nr.: CRCW06030000Z0EBC; Manufacturer 2: Vishay / Draloric
R275 R277 R279 R281 = RES_0402_110R_1%: Thick Film Resistors - SMD 110Ohm 1%; Manufacturer 1: Vishay / Dale; Manufacturer 1 Prt. Nr.: CRCW0402110RFKTD; Manufacturer 2 Prt. Nr.: RC0402FR-7W110RL; Manufacturer 2: Yageo
R276 R278 R280 R282 = RES_0402_200R 1%: Thick Film Resistors - SMD 200Ohm 1%; Manufacturer 1: Vishay / Dale; Manufacturer 1 Prt. Nr.: CRCW0402200RFKEDC; Manufacturer 2 Prt. Nr.: AF0402FR-07200RL; Manufacturer 2: Yageo

## Sheet SMI Bank 12.SchDoc
size A3; SheetNumber: 10; SheetTotal: 22
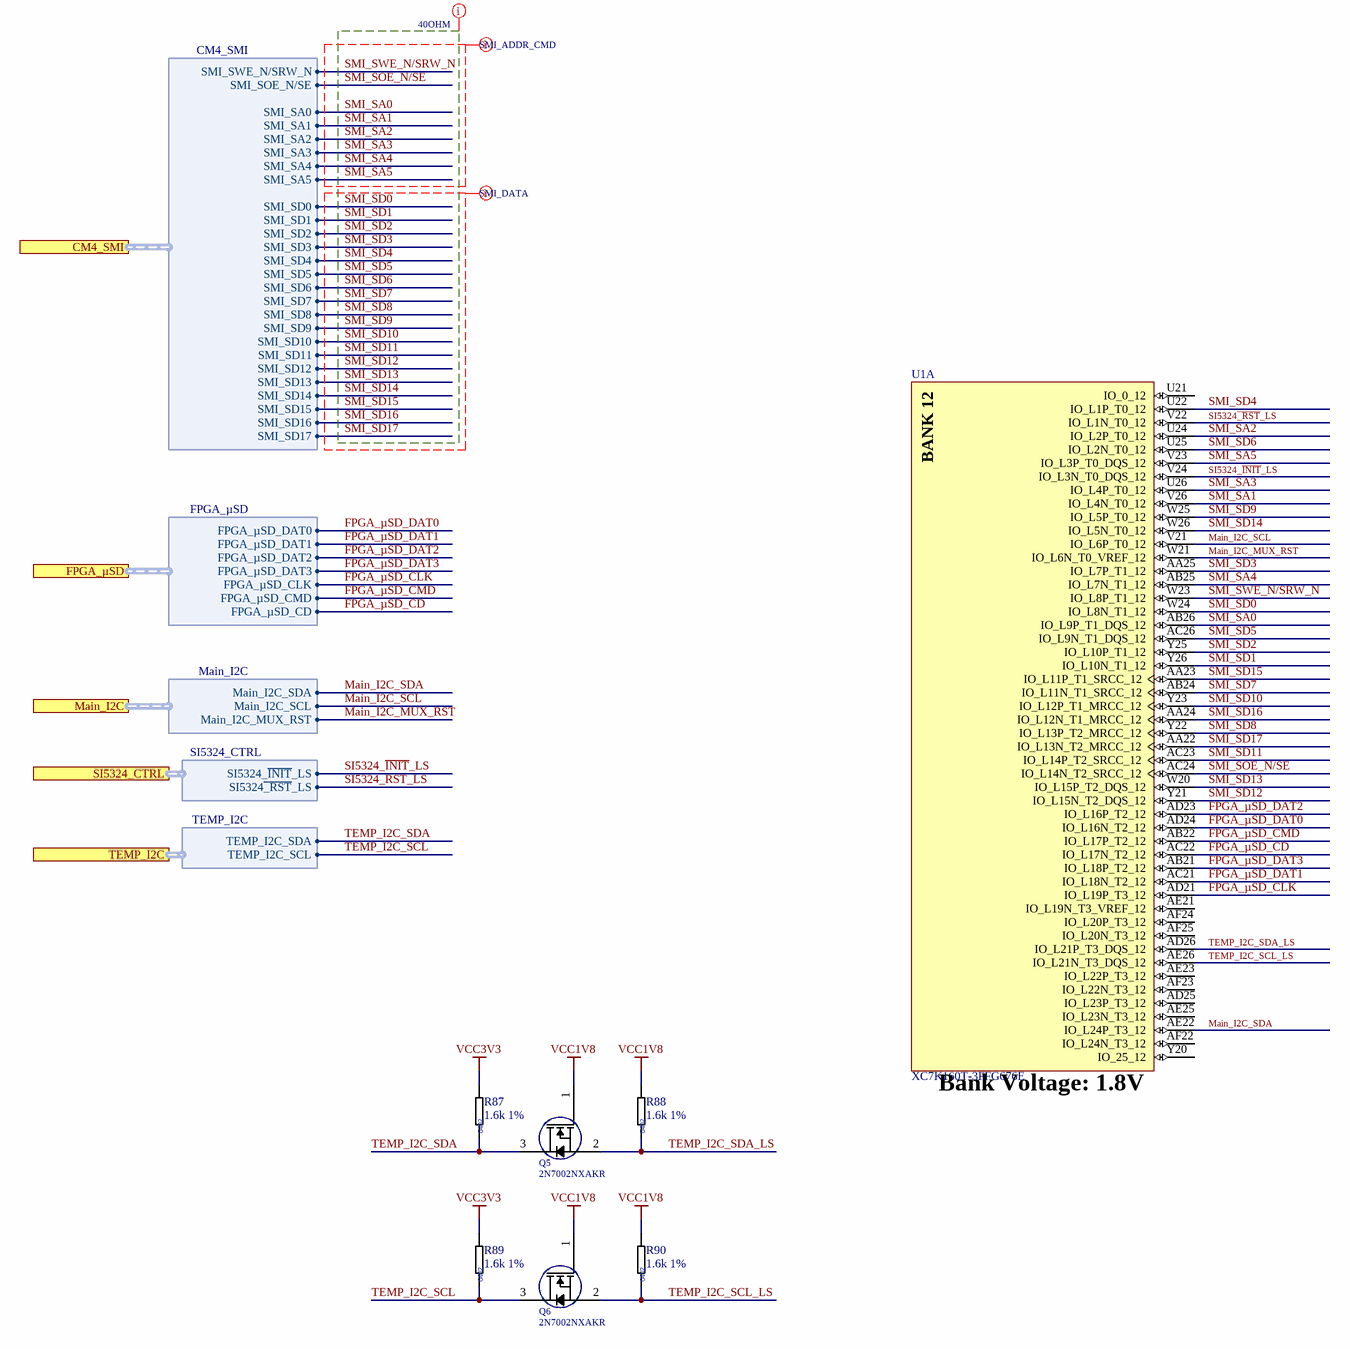
[diagram p11: SMI Bank 12.SchDoc]

### Parts
Q5  2N7002NXAKR  [SOT95P251X112-3N]
Q6  2N7002NXAKR  [SOT95P251X112-3N]
R87  1.6k 1%  [RES_0402_L]
R88  1.6k 1%  [RES_0402_L]
R89  1.6k 1%  [RES_0402_L]
R90  1.6k 1%  [RES_0402_L]
U1  XC7K160T-3FFG676E  [BGA100P2700X2700X317-676N]  (part A of 14)

### Ports
CM4_SMI (harness CM4_SMI, see Top-Level-Sheet[4B], Raspberry Pi CM4[8D]), FPGA_µSD (harness FPGA_µSD, see Top-Level-Sheet[4B], QSPI Flash_eMMC_uSD-Card[1C]), Main_I2C (harness Main_I2C, see Top-Level-Sheet[4B], I2C Multiplexer[1A]), SI5324_CTRL (harness SI5324_CTRL, see Top-Level-Sheet[4B], System Clocks[1A]), TEMP_I2C (harness TEMP_I2C, see Top-Level-Sheet[4B], Buck Modules[1D])

### Harnesses
CM4_SMI: SMI_SOE_N/SE, SMI_SA0, SMI_SD0, SMI_SWE_N/SRW_N, SMI_SA1, SMI_SA2, SMI_SA3, SMI_SA4, SMI_SA5, SMI_SD1, SMI_SD2, SMI_SD3, SMI_SD4, SMI_SD5, SMI_SD6, SMI_SD7, SMI_SD8, SMI_SD9, SMI_SD10, SMI_SD11, SMI_SD12, SMI_SD13, SMI_SD14, SMI_SD15, SMI_SD16, SMI_SD17
FPGA_µSD: FPGA_µSD_DAT0, FPGA_µSD_DAT1, FPGA_µSD_DAT3, FPGA_µSD_CLK, FPGA_µSD_CMD, FPGA_µSD_DAT2, FPGA_µSD_CD
Main_I2C: Main_I2C_SCL, Main_I2C_MUX_RST, Main_I2C_SDA
SI5324_CTRL: SI5324_~{INIT}_LS, SI5324~{_RST}_LS
TEMP_I2C: TEMP_I2C_SCL, TEMP_I2C_SDA

### Nets
VCC1V8: Q5.1(G) Q6.1(G) R88.2 R90.2
VCC3V3: R87.2 R89.2
FPGA_µSD_CD: U1.AC22(IO_L17N_T2_12) ; port FPGA_µSD.FPGA_µSD_CD
FPGA_µSD_CLK: U1.AD21(IO_L19P_T3_12) ; port FPGA_µSD.FPGA_µSD_CLK
FPGA_µSD_CMD: U1.AB22(IO_L17P_T2_12) ; port FPGA_µSD.FPGA_µSD_CMD
FPGA_µSD_DAT0: U1.AD24(IO_L16N_T2_12) ; port FPGA_µSD.FPGA_µSD_DAT0
FPGA_µSD_DAT1: U1.AC21(IO_L18N_T2_12) ; port FPGA_µSD.FPGA_µSD_DAT1
FPGA_µSD_DAT2: U1.AD23(IO_L16P_T2_12) ; port FPGA_µSD.FPGA_µSD_DAT2
FPGA_µSD_DAT3: U1.AB21(IO_L18P_T2_12) ; port FPGA_µSD.FPGA_µSD_DAT3
Main_I2C_MUX_RST: U1.W21(IO_L6N_T0_VREF_12) ; port Main_I2C.Main_I2C_MUX_RST
Main_I2C_SCL: U1.V21(IO_L6P_T0_12) ; port Main_I2C.Main_I2C_SCL
Main_I2C_SDA: U1.AE22(IO_L24P_T3_12) ; port Main_I2C.Main_I2C_SDA
SI5324~{_RST}_LS: U1.V22(IO_L1N_T0_12) ; port SI5324_CTRL.SI5324~{_RST}_LS
SI5324_~{INIT}_LS: U1.V24(IO_L3N_T0_DQS_12) ; port SI5324_CTRL.SI5324_~{INIT}_LS
SMI_SA0: U1.AB26(IO_L9P_T1_DQS_12) ; port CM4_SMI.SMI_SA0
SMI_SA1: U1.V26(IO_L4N_T0_12) ; port CM4_SMI.SMI_SA1
SMI_SA2: U1.U24(IO_L2P_T0_12) ; port CM4_SMI.SMI_SA2
SMI_SA3: U1.U26(IO_L4P_T0_12) ; port CM4_SMI.SMI_SA3
SMI_SA4: U1.AB25(IO_L7N_T1_12) ; port CM4_SMI.SMI_SA4
SMI_SA5: U1.V23(IO_L3P_T0_DQS_12) ; port CM4_SMI.SMI_SA5
SMI_SD0: U1.W24(IO_L8N_T1_12) ; port CM4_SMI.SMI_SD0
SMI_SD1: U1.Y26(IO_L10N_T1_12) ; port CM4_SMI.SMI_SD1
SMI_SD2: U1.Y25(IO_L10P_T1_12) ; port CM4_SMI.SMI_SD2
SMI_SD3: U1.AA25(IO_L7P_T1_12) ; port CM4_SMI.SMI_SD3
SMI_SD4: U1.U22(IO_L1P_T0_12) ; port CM4_SMI.SMI_SD4
SMI_SD5: U1.AC26(IO_L9N_T1_DQS_12) ; port CM4_SMI.SMI_SD5
SMI_SD6: U1.U25(IO_L2N_T0_12) ; port CM4_SMI.SMI_SD6
SMI_SD7: U1.AB24(IO_L11N_T1_SRCC_12) ; port CM4_SMI.SMI_SD7
SMI_SD8: U1.Y22(IO_L13P_T2_MRCC_12) ; port CM4_SMI.SMI_SD8
SMI_SD9: U1.W25(IO_L5P_T0_12) ; port CM4_SMI.SMI_SD9
SMI_SD10: U1.Y23(IO_L12P_T1_MRCC_12) ; port CM4_SMI.SMI_SD10
SMI_SD11: U1.AC23(IO_L14P_T2_SRCC_12) ; port CM4_SMI.SMI_SD11
SMI_SD12: U1.Y21(IO_L15N_T2_DQS_12) ; port CM4_SMI.SMI_SD12
SMI_SD13: U1.W20(IO_L15P_T2_DQS_12) ; port CM4_SMI.SMI_SD13
SMI_SD14: U1.W26(IO_L5N_T0_12) ; port CM4_SMI.SMI_SD14
SMI_SD15: U1.AA23(IO_L11P_T1_SRCC_12) ; port CM4_SMI.SMI_SD15
SMI_SD16: U1.AA24(IO_L12N_T1_MRCC_12) ; port CM4_SMI.SMI_SD16
SMI_SD17: U1.AA22(IO_L13N_T2_MRCC_12) ; port CM4_SMI.SMI_SD17
SMI_SOE_N/SE: U1.AC24(IO_L14N_T2_SRCC_12) ; port CM4_SMI.SMI_SOE_N/SE
SMI_SWE_N/SRW_N: U1.W23(IO_L8P_T1_12) ; port CM4_SMI.SMI_SWE_N/SRW_N
TEMP_I2C_SCL: Q6.3(D) R89.1 ; port TEMP_I2C.TEMP_I2C_SCL
TEMP_I2C_SCL_LS: Q6.2(S) R90.1 U1.AE26(IO_L21N_T3_DQS_12)
TEMP_I2C_SDA: Q5.3(D) R87.1 ; port TEMP_I2C.TEMP_I2C_SDA
TEMP_I2C_SDA_LS: Q5.2(S) R88.1 U1.AD26(IO_L21P_T3_DQS_12)

Not connected (* = marked no-connect by the designer): U1 AD25(IO_L23P_T3_12) AE21(IO_L19N_T3_VREF_12) AE23(IO_L22P_T3_12) AE25(IO_L23N_T3_12) AF22(IO_L24N_T3_12) AF23(IO_L22N_T3_12) AF24(IO_L20P_T3_12) AF25(IO_L20N_T3_12) U21(IO_0_12) Y20(IO_25_12)

### Layout directives
net class SMI_ADDR_CMD: SMI_SA0, SMI_SA1, SMI_SA2, SMI_SA3, SMI_SA4, SMI_SA5, SMI_SOE_N/SE, SMI_SWE_N/SRW_N
net class SMI_DATA: SMI_SD0, SMI_SD1, SMI_SD2, SMI_SD3, SMI_SD4, SMI_SD5, SMI_SD6, SMI_SD7, SMI_SD8, SMI_SD9, SMI_SD10, SMI_SD11, SMI_SD12, SMI_SD13, SMI_SD14, SMI_SD15, SMI_SD16, SMI_SD17
net class 40OHM: SMI_SA0, SMI_SA1, SMI_SA2, SMI_SA3, SMI_SA4, SMI_SA5, SMI_SD0, SMI_SD1, SMI_SD2, SMI_SD3, SMI_SD4, SMI_SD5, SMI_SD6, SMI_SD7, SMI_SD8, SMI_SD9, SMI_SD10, SMI_SD11, SMI_SD12, SMI_SD13, SMI_SD14, SMI_SD15, SMI_SD16, SMI_SD17, SMI_SOE_N/SE, SMI_SWE_N/SRW_N

### Notes on the sheet
- (near U1) Bank Voltage: 1.8V
- Title:
- ++CONFIDENTIAL++
- Datum:
- Blatt:
- von:
- Zeit:
- Entwickler:
- Elektronik- und Softwareentwicklung aus Nürnberg
- The  information  contained  in  these  documents  is  confidential,  privileged  and  only  for  the
  information of the intended recipient and may
  not be used, published or redistributed without
  the prior written consent from PCB Arts GmbH.
- Revision:
- Checked:
- https://pcb-arts.com/
- mail@pcb-arts.com
- (in symbol RES_0402_1.6k_1%) 0402
- (in symbol XC7K160T-3FFG676E_Kintex-7 FPGA, 400 User I/Os, 8 GTX, FFG676, part A) BANK 12

### Library data of the parts
Q5 Q6 = 2N7002NXAKR_MOSFET 60V SGL N-CH TRENCHMOS: MOSFET 60V SGL N-CH TRENCHMOS; Manufacturer 1: Nexperia; Manufacturer 1 Prt. Nr.: 2N7002NXAKR
R87-R90 = RES_0402_1.6k_1%: Thick Film Resistors - SMD 1.6kOhm 1%; Manufacturer 1: Vishay / Dale; Manufacturer 1 Prt. Nr.: CRCW04021K60FKEDC; Manufacturer 2 Prt. Nr.: RC0402FR-7W1K6L; Manufacturer 2: Yageo
U1 = XC7K160T-3FFG676E_Kintex-7 FPGA, 400 User I/Os, 8 GTX, FFG676: Kintex-7 FPGA, 400 User I/Os, 8 GTX, 676-Ball BGA, Speed Grade 3, Extended Grade, Pb-Free; Manufacturer 1: Xilinx; Manufacturer 1 Prt. Nr.: XC7K160T-3FFG676E; ComponentLink1URL: http://www.xilinx.com/support/documentation/data_sheets/ds180_7Series_Overview.pdf; ComponentLink2URL: http://www.xilinx.com/support/documentation/user_guides/ug865-Zynq-7000-Pkg-Pinout.pdf; ComponentLink1Description: Datasheet; ComponentLink2Description: Package Specification

## Sheet SSD M.2_B-Key.SchDoc
size A3; SheetNumber: 6; SheetTotal: 21
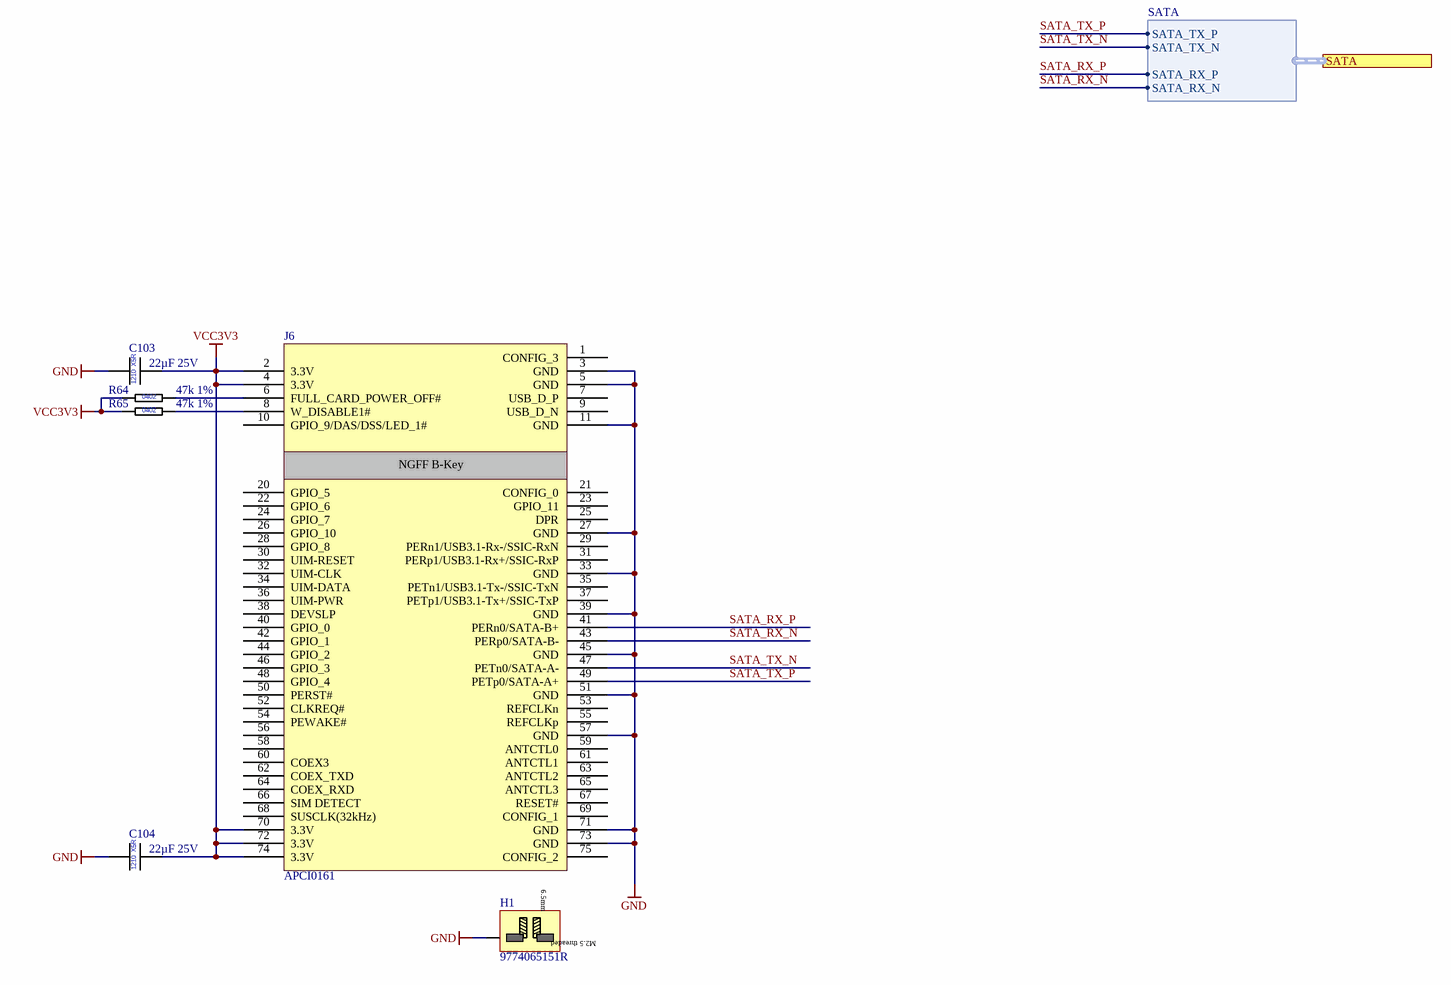
[diagram p12: SSD M.2_B-Key.SchDoc]

### Parts
C103  22µF 25V  [CAP_1210]
C104  22µF 25V  [CAP_1210]
H1  9774065151R  [9774065151R]
J6  APCI0161  [APCI0161-P001A]
R64  47k 1%  [RES_0402_L]
R65  47k 1%  [RES_0402_L]

### Ports
SATA (harness SATA, see Top-Level-Sheet[6B], MGT Banks 115-116[8C])

### Harnesses
SATA: SATA_TX_P, SATA_TX_N, SATA_RX_P, SATA_RX_N

### Nets
GND: C103.1 C104.1 H1.1 J6.3(GND) J6.5(GND) J6.11(GND) J6.27(GND) J6.33(GND) J6.39(GND) J6.45(GND) J6.51(GND) J6.57(GND) J6.71(GND) J6.73(GND)
VCC3V3: C103.2 C104.2 J6.2(3.3V) J6.4(3.3V) J6.70(3.3V) J6.72(3.3V) J6.74(3.3V) R64.1 R65.1
SATA_RX_N: J6.43(PERp0/SATA-B-) ; port SATA.SATA_RX_N
SATA_RX_P: J6.41(PERn0/SATA-B+) ; port SATA.SATA_RX_P
SATA_TX_N: J6.47(PETn0/SATA-A-) ; port SATA.SATA_TX_N
SATA_TX_P: J6.49(PETp0/SATA-A+) ; port SATA.SATA_TX_P
NetJ6_6: J6.6(FULL_CARD_POWER_OFF#) R64.2
NetJ6_8: J6.8(W_DISABLE1#) R65.2

Not connected (* = marked no-connect by the designer): J6 1(CONFIG_3) 7(USB_D_P) 9(USB_D_N) 10(GPIO_9/DAS/DSS/LED_1#) 20(GPIO_5) 21(CONFIG_0) 22(GPIO_6) 23(GPIO_11) 24(GPIO_7) 25(DPR) 26(GPIO_10) 28(GPIO_8) 29(PERn1/USB3.1-Rx-/SSIC-RxN) 30(UIM-RESET) 31(PERp1/USB3.1-Rx+/SSIC-RxP) 32(UIM-CLK) 34(UIM-DATA) 35(PETn1/USB3.1-Tx-/SSIC-TxN) 36(UIM-PWR) 37(PETp1/USB3.1-Tx+/SSIC-TxP) 38(DEVSLP) 40(GPIO_0) 42(GPIO_1) 44(GPIO_2) 46(GPIO_3) 48(GPIO_4) 50(PERST#) 52(CLKREQ#) 53(REFCLKn) 54(PEWAKE#) 55(REFCLKp) 56 58 59(ANTCTL0) 60(COEX3) 61(ANTCTL1) 62(COEX_TXD) 63(ANTCTL2) 64(COEX_RXD) 65(ANTCTL3) 66(SIM_DETECT) 67(RESET#) 68(SUSCLK(32kHz)) 69(CONFIG_1) 75(CONFIG_2)

### Notes on the sheet
- Title:
- ++CONFIDENTIAL++
- Datum:
- Blatt:
- von:
- Zeit:
- Entwickler:
- Elektronik- und Softwareentwicklung aus Nürnberg
- The  information  contained  in  these  documents  is  confidential,  privileged  and  only  for  the
  information of the intended recipient and may
  not be used, published or redistributed without
  the prior written consent from PCB Arts GmbH.
- Revision:
- Checked:
- https://pcb-arts.com/
- mail@pcb-arts.com
- (in symbol APCI0161-NGFF B-Key Card Edge Connector 8.5mm Height) NGFF B-Key
- (in symbol CAP_1210_22µF_25V) X5R; 1210
- (in symbol RES_0402_47k_1%) 0402
- (in symbol Würth Standoff M2.5 h:6.5mm) 6.5mm; M2.5 threaded

### Library data of the parts
C103 C104 = CAP_1210_22µF_25V: as C87 on sheet SFP+_Connectors; Manufacturer 2: Taiyo Yuden
H1 = Würth Standoff M2.5 h:6.5mm: Würth Standoff M2.5 h:6.5mm 9774065151R; Manufacturer 1: Würth Elektronik; Manufacturer 1 Prt. Nr.: 9774065151R
J6 = APCI0161-NGFF B-Key Card Edge Connector 8.5mm Height: NGFF B-Key Card Edge Connector 8.5mm Height; Manufacturer 1: Lotes; Manufacturer 1 Prt. Nr.: APCI0161
R64 R65 = RES_0402_47k_1%: Thick Film Resistors - SMD 47kOhm 1%; Manufacturer 1: Vishay / Dale; Manufacturer 1 Prt. Nr.: CRCW040247K0FKEDC; Manufacturer 2 Prt. Nr.: RC0402FR-7W47KL; Manufacturer 2: Yageo

## Sheet USB-HUB-MUX.SchDoc
size A3; SheetNumber: 9; SheetTotal: 22
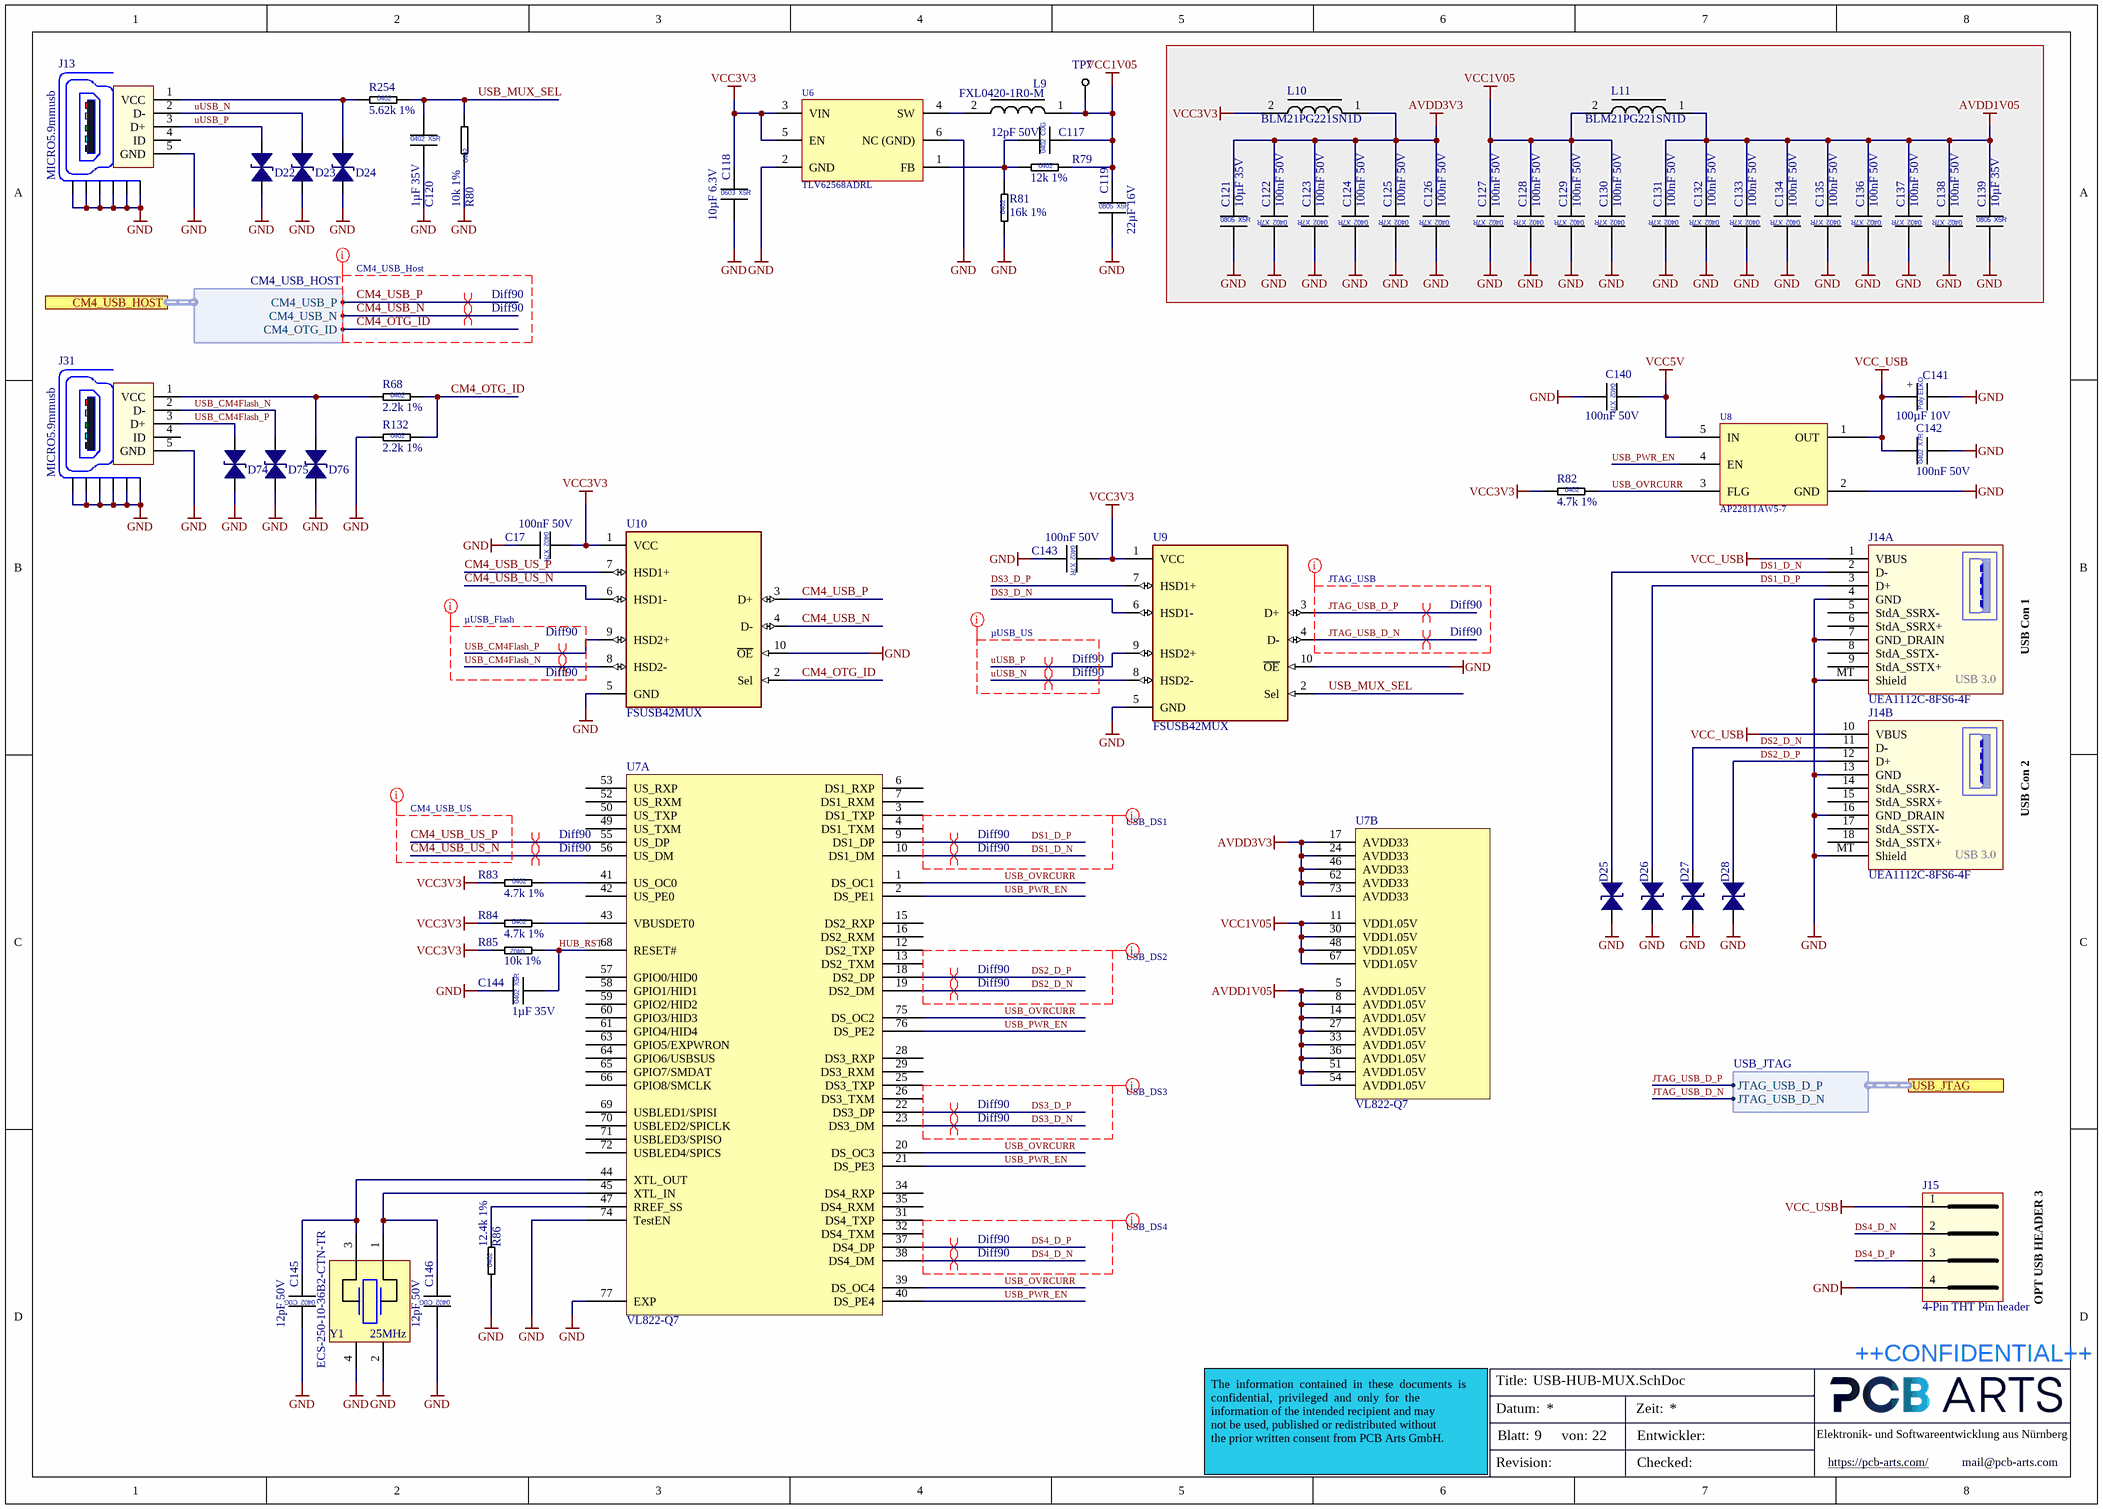
[diagram p13: USB-HUB-MUX.SchDoc]

### Parts
C17  100nF 50V  [CAP_0402_L]
C117  12pF 50V  [CAP_0402_L]
C118  10µF 6.3V  [CAP_0603_L]
C119  22µF 16V  [CAP_0805]
C120  1µF 35V  [CAP_0402_L]
C121  10µF 35V  [CAP_0805]
C122  100nF 50V  [CAP_0402_L]
C123  100nF 50V  [CAP_0402_L]
C124  100nF 50V  [CAP_0402_L]
C125  100nF 50V  [CAP_0402_L]
C126  100nF 50V  [CAP_0402_L]
C127  100nF 50V  [CAP_0402_L]
C128  100nF 50V  [CAP_0402_L]
C129  100nF 50V  [CAP_0402_L]
C130  100nF 50V  [CAP_0402_L]
C131  100nF 50V  [CAP_0402_L]
C132  100nF 50V  [CAP_0402_L]
C133  100nF 50V  [CAP_0402_L]
C134  100nF 50V  [CAP_0402_L]
C135  100nF 50V  [CAP_0402_L]
C136  100nF 50V  [CAP_0402_L]
C137  100nF 50V  [CAP_0402_L]
C138  100nF 50V  [CAP_0402_L]
C139  10µF 35V  [CAP_0805]
C140  100nF 50V  [CAP_0402_L]
C141  100µF 10V  [WCAP-ASLI_D5H5.5]
C142  100nF 50V  [CAP_0402_L]
C143  100nF 50V  [CAP_0402_L]
C144  1µF 35V  [CAP_0402_L]
C145  12pF 50V  [CAP_0402_L]
C146  12pF 50V  [CAP_0402_L]
D22  CESDP0402UC5VB  [TVS_0402]  (value not drawn)
D23  CESDP0402UC5VB  [TVS_0402]  (value not drawn)
D24  CESDP0402UC5VB  [TVS_0402]  (value not drawn)
D25  CESDP0402UC5VB  [TVS_0402]  (value not drawn)
D26  CESDP0402UC5VB  [TVS_0402]  (value not drawn)
D27  CESDP0402UC5VB  [TVS_0402]  (value not drawn)
D28  CESDP0402UC5VB  [TVS_0402]  (value not drawn)
D74  CESDP0402UC5VB  [TVS_0402]  (value not drawn)
D75  CESDP0402UC5VB  [TVS_0402]  (value not drawn)
D76  CESDP0402UC5VB  [TVS_0402]  (value not drawn)
J13  MICRO5.9mmusb  [MICRO5.9mmusb]
J14  UEA1112C-8FS6-4F  [UEA1112C-8FS6-4F]  (parts A,B of 2)
J15  4-Pin THT Pin header  [61300411121]
J31  MICRO5.9mmusb  [MICRO5.9mmusb]
L9  FXL0420-1R0-M  [FXL0420-1R0-M]
L10  BLM21PG221SN1D  [L_0805]
L11  BLM21PG221SN1D  [L_0805]
R68  2.2k 1%  [RES_0402_L]
R79  12k 1%  [RES_0402_L]
R80  10k 1%  [RES_0402_L]
R81  16k 1%  [RES_0402_L]
R82  4.7k 1%  [RES_0402_L]
R83  4.7k 1%  [RES_0402_L]
R84  4.7k 1%  [RES_0402_L]
R85  10k 1%  [RES_0402_L]
R86  12.4k 1%  [RES_0402_L]
R132  2.2k 1%  [RES_0402_L]
R254  5.62k 1%  [RES_0402_L]
TP7  Testpoint  [Testpoint 0.8mm]  (value not drawn)  (no BOM)
U6  TLV62568ADRL  [SON50P150X80-6N]
U7  VL822-Q7  [QFN50P900X900X85-76N]  (parts A,B of 2)
U8  AP22811AW5-7  [SOT95P285X140-5N]
U9  FSUSB42MUX  [SOP50P300X300X110-10N]
U10  FSUSB42MUX  [SOP50P300X300X110-10N]
Y1  ECS-250-10-36B2-CTN-TR  Frequency: 25MHz  [ECX-2236B]

### Ports
CM4_USB_HOST (harness CM4_USB_HOST, see Top-Level-Sheet[3B], Raspberry Pi CM4[8B]), USB_JTAG (harness USB_JTAG, see Top-Level-Sheet[3B], Bank 0_Bank 14[8A])

### Harnesses
CM4_USB_HOST: CM4_USB_P, CM4_USB_N, CM4_OTG_ID
USB_JTAG: JTAG_USB_D_P, JTAG_USB_D_N

### Nets
AVDD1V05: C131.2 C132.2 C133.2 C134.2 C135.2 C136.2 C137.2 C138.2 C139.1 L11.1 U7.5(AVDD1.05V) U7.8(AVDD1.05V) U7.14(AVDD1.05V) U7.27(AVDD1.05V) U7.33(AVDD1.05V) U7.36(AVDD1.05V) U7.51(AVDD1.05V) U7.54(AVDD1.05V)
AVDD3V3: C121.1 C122.2 C123.2 C124.2 C125.2 C126.2 L10.1 U7.17(AVDD33) U7.24(AVDD33) U7.46(AVDD33) U7.62(AVDD33) U7.73(AVDD33)
GND: C17.2 C118.2 C119.2 C120.2 C121.2 C122.1 C123.1 C124.1 C125.1 C126.1 C127.1 C128.1 C129.1 C130.1 C131.1 C132.1 C133.1 C134.1 C135.1 C136.1 C137.1 C138.1 C139.2 C140.2 C141.2 C142.2 C143.2 C144.1 C145.1 C146.1 D22.2 D23.2 D24.2 D25.1 D26.1 D27.1 D28.1 D74.2 D75.2 D76.2 J13.5(GND) J13.6(Shield) J13.7(Shield) J13.8(Shield) J13.9(Shield) J13.10(Shield) J13.11(Shield) J14.4(GND) J14.7(GND_DRAIN) J14.13(GND) J14.16(GND_DRAIN) J14.MT(Shield) J15.4 J31.5(GND) J31.6(Shield) J31.7(Shield) J31.8(Shield) J31.9(Shield) J31.10(Shield) J31.11(Shield) R80.1 R81.1 R86.1 R132.1 U6.2(GND) U6.6(NC_(GND)) U7.74(TestEN) U7.77(EXP) U8.2(GND) U9.5(GND) U9.10(~{OE}) U10.5(GND) U10.10(~{OE}) Y1.2 Y1.4
VCC1V05: C117.2 C119.1 C127.2 C128.2 C129.2 C130.2 L9.1 L11.2 R79.2 TP7.1(GND) U7.11(VDD1.05V) U7.30(VDD1.05V) U7.48(VDD1.05V) U7.67(VDD1.05V)
VCC3V3: C17.1 C118.1 C143.1 L10.2 R82.1 R83.1 R84.1 R85.2 U6.3(VIN) U6.5(EN) U9.1(VCC) U10.1(VCC)
VCC5V: C140.1 U8.5(IN)
VCC_USB: C141.1 C142.1 J14.1(VBUS) J14.10(VBUS) J15.1 U8.1(OUT)
CM4_OTG_ID: R68.2 R132.2 U10.2(Sel) ; port CM4_USB_HOST.CM4_OTG_ID
CM4_USB_N: U10.4(D-) ; port CM4_USB_HOST.CM4_USB_N
CM4_USB_P: U10.3(D+) ; port CM4_USB_HOST.CM4_USB_P
CM4_USB_US_N: U7.56(US_DM) U10.6(HSD1-)
CM4_USB_US_P: U7.55(US_DP) U10.7(HSD1+)
DS1_D_N: D25.2 J14.2(D-) U7.10(DS1_DM)
DS1_D_P: D26.2 J14.3(D+) U7.9(DS1_DP)
DS2_D_N: D27.2 J14.11(D-) U7.19(DS2_DM)
DS2_D_P: D28.2 J14.12(D+) U7.18(DS2_DP)
DS3_D_N: U7.23(DS3_DM) U9.6(HSD1-)
DS3_D_P: U7.22(DS3_DP) U9.7(HSD1+)
DS4_D_N: J15.2 U7.38(DS4_DM)
DS4_D_P: J15.3 U7.37(DS4_DP)
HUB_RST: C144.2 R85.1 U7.68(RESET#)
JTAG_USB_D_N: U9.4(D-) ; port USB_JTAG.JTAG_USB_D_N
JTAG_USB_D_P: U9.3(D+) ; port USB_JTAG.JTAG_USB_D_P
USB_CM4Flash_N: D75.1 J31.2(D-) U10.8(HSD2-)
USB_CM4Flash_P: D74.1 J31.3(D+) U10.9(HSD2+)
USB_MUX_SEL: C120.1 R80.2 R254.2 U9.2(Sel)
USB_OVRCURR: R82.2 U7.1(DS_OC1) U7.20(DS_OC3) U7.39(DS_OC4) U7.75(DS_OC2) U8.3(FLG)
USB_PWR_EN: U7.2(DS_PE1) U7.21(DS_PE3) U7.40(DS_PE4) U7.76(DS_PE2) U8.4(EN)
uUSB_N: D23.1 J13.2(D-) U9.8(HSD2-)
uUSB_P: D22.1 J13.3(D+) U9.9(HSD2+)
NetC117_1: C117.1 R79.1 R81.2 U6.1(FB)
NetC145_2: C145.2 U7.44(XTL_OUT) Y1.3
NetC146_2: C146.2 U7.45(XTL_IN) Y1.1
NetD24_1: D24.1 J13.1(VCC) R254.1
NetD76_1: D76.1 J31.1(VCC) R68.1
NetL9_2: L9.2 U6.4(SW)
NetR83_2: R83.2 U7.41(US_OC0)
NetR84_2: R84.2 U7.43(VBUSDET0)
NetR86_2: R86.2 U7.47(RREF_SS)

Not connected (* = marked no-connect by the designer): J13 4(ID); J14 5(StdA_SSRX-) 6(StdA_SSRX+) 8(StdA_SSTX-) 9(StdA_SSTX+) 14(StdA_SSRX-) 15(StdA_SSRX+) 17(StdA_SSTX-) 18(StdA_SSTX+); J31 4(ID); U7 3(DS1_TXP) 4(DS1_TXM) 6(DS1_RXP) 7(DS1_RXM) 12(DS2_TXP) 13(DS2_TXM) 15(DS2_RXP) 16(DS2_RXM) 25(DS3_TXP) 26(DS3_TXM) 28(DS3_RXP) 29(DS3_RXM) 31(DS4_TXP) 32(DS4_TXM) 34(DS4_RXP) 35(DS4_RXM) 42(US_PE0) 49(US_TXM) 50(US_TXP) 52(US_RXM) 53(US_RXP) 57(GPIO0/HID0) 58(GPIO1/HID1) 59(GPIO2/HID2) 60(GPIO3/HID3) 61(GPIO4/HID4) 63(GPIO5/EXPWRON) 64(GPIO6/USBSUS) 65(GPIO7/SMDAT) 66(GPIO8/SMCLK) 69(USBLED1/SPISI) 70(USBLED2/SPICLK) 71(USBLED3/SPISO) 72(USBLED4/SPICS)

### Layout directives
net class USB_DS4: DS4_D_N, DS4_D_P
differential pair; net class Diff90: CM4_USB_N, CM4_USB_P, CM4_USB_US_N, CM4_USB_US_P, DS1_D_N, DS1_D_P, DS2_D_N, DS2_D_P, DS3_D_N, DS3_D_P, DS4_D_N, DS4_D_P, JTAG_USB_D_N, JTAG_USB_D_P, USB_CM4Flash_N, USB_CM4Flash_P, uUSB_N, uUSB_P
net class USB_DS3: DS3_D_N, DS3_D_P
net class USB_DS2: DS2_D_N, DS2_D_P
net class USB_DS1: DS1_D_N, DS1_D_P
net class µUSB_US: uUSB_N, uUSB_P
net class JTAG_USB: JTAG_USB_D_N, JTAG_USB_D_P
net class µUSB_Flash: USB_CM4Flash_N, USB_CM4Flash_P
net class CM4_USB_Host: CM4_OTG_ID, CM4_USB_N, CM4_USB_P
net class CM4_USB_US: CM4_USB_US_N, CM4_USB_US_P

### Notes on the sheet
- USB Con 1
- USB Con 2
- OPT USB HEADER 3
- Title:
- ++CONFIDENTIAL++
- Datum:
- Blatt:
- von:
- Zeit:
- Entwickler:
- Elektronik- und Softwareentwicklung aus Nürnberg
- The  information  contained  in  these  documents  is  confidential,  privileged  and  only  for  the
  information of the intended recipient and may
  not be used, published or redistributed without
  the prior written consent from PCB Arts GmbH.
- Revision:
- Checked:
- https://pcb-arts.com/
- mail@pcb-arts.com
- (in symbol CAP_0402_1µF_35V) X5R; 0402
- (in symbol CAP_0402_12pF_50V) C0G; 0402
- (in symbol CAP_0402_100nF_50V) X7R; 0402
- (in symbol CAP_0603_10µF_6.3V) 0603; X5R
- (in symbol CAP_0805_10µF_35V) 0805; X5R
- (in symbol CAP_0805_22µF_16V) 0805; X5R
- (in symbol CAP_D5L5.5_100µF_10V) +; Poly ELKO
- (in symbol RES_0402_2.2k_1%) 0402
- (in symbol RES_0402_4.7k_1%) 0402
- (in symbol RES_0402_5.62k_1%) 0402
- (in symbol RES_0402_10k_1%) 0402
- (in symbol RES_0402_12.4k_1%) 0402
- (in symbol RES_0402_12k_1%) 0402
- (in symbol RES_0402_16k_1%) 0402
- (in symbol UEA1112C-8FS6-4F_Dual USB 3.0 Horizontal Type A_1, part A) USB 3.0
- (in symbol UEA1112C-8FS6-4F_Dual USB 3.0 Horizontal Type A_1, part B) USB 3.0

### Library data of the parts
C17 C122-C138 C140 C142 C143 = CAP_0402_100nF_50V: as C105 on sheet Raspberry Pi CM4; Manufacturer 2: TDK
C117 C145 C146 = CAP_0402_12pF_50V: Multilayer Ceramic Capacitors MLCC - SMD/SMT 0402 50VDC; Manufacturer 1: Murata Electronics; Manufacturer 1 Prt. Nr.: GCM1555C1H120JA16J; Manufacturer 2 Prt. Nr.: C0402C120J5GACTU; Manufacturer 2: KEMET
C118 = CAP_0603_10µF_6.3V: Multilayer Ceramic Capacitors MLCC - SMD/SMT 0603 6.3VDC; Manufacturer 1: Murata Electronics; Manufacturer 1 Prt. Nr.: GRM188R60J106ME84J; Manufacturer 2 Prt. Nr.: JMK107ABJ106MA-T; Manufacturer 2: Taiyo Yuden
C119 = CAP_0805_22µF_16V: Multilayer Ceramic Capacitors MLCC - SMD/SMT 0805 16VDC; Manufacturer 1: Samsung Electro-Mechanics; Manufacturer 1 Prt. Nr.: CL21A226KOQNNNG; Manufacturer 2 Prt. Nr.: GRM21BC81C226ME44K; Manufacturer 2: Murata Electronics
C120 C144 = CAP_0402_1µF_35V: Multilayer Ceramic Capacitors MLCC - SMD/SMT 0402 35VDC; Manufacturer 1: Kyocera Electronic Components; Manufacturer 1 Prt. Nr.: CM05X5R105K35AH; Manufacturer 2 Prt. Nr.: C1005X5R1V105K050BC; Manufacturer 2: TDK
C121 C139 = CAP_0805_10µF_35V: Multilayer Ceramic Capacitors MLCC - SMD/SMT 0805 35VDC; Manufacturer 1: Murata Electronics; Manufacturer 1 Prt. Nr.: GRM21BR6YA106ME43L; Manufacturer 2 Prt. Nr.: C2012X5R1V106M085AC; Manufacturer 2: TDK
C141 = CAP_D5L5.5_100µF_10V: Organische Polymer-Aluminiumkondensatoren 100uF 10 Volts 20%; Manufacturer 1: Würth Elektronik; Manufacturer 1 Prt. Nr.: 875105242010
D22-D28 D74-D76 = CESDP0402UC5VB_TVS Diode 0402: Low Capacitance ESD Protection Diode 0402; Manufacturer 1: CREATEK; Manufacturer 2 Prt. Nr.: BPESD0402-05ST; Manufacturer 1 Prt. Nr.: CESDP0402UC5VB; Manufacturer 2: BORN
J13 J31 = SMD micro USB Connector Horizontal C393940: SHOU HAN  MICRO5.9mmusb; Manufacturer 1: SHOU HAN; Manufacturer 1 Prt. Nr.: MICRO5.9mmusb
J14 = UEA1112C-8FS6-4F_Dual USB 3.0 Horizontal Type A_1: Dual USB 3.0 Horizontal Type A; Manufacturer 1: Foxconn; Manufacturer 2 Prt. Nr.: USB-HX-19DIP; Manufacturer 1 Prt. Nr.: UEA1112C-8FS6-4F; Manufacturer 2: HDGC
J15 = 61300411121_WR-PHD 2.54mm 4Pin THT Header: WR-PHD 2.54mm 4Pin THT Header; Manufacturer 1: Würth Elektronik; Manufacturer 1 Prt. Nr.: 61300411121
L9 = 1uH 6A 27mΩ  FXL0420-1R0-M: 1uH ±20% 6A 27mΩ SMD,4.4x4.5x1.8mm Power Inductor; Manufacturer 1: cjiang(Changjiang Microelectronics Tech); Manufacturer 1 Prt. Nr.: FXL0420-1R0-M
L10 L11 = Ferrite Beads 0805 220 OHM BLM21PG221SN1D: Ferrite Beads 0805 220 OHM; Manufacturer 1: Murata Electronics; Manufacturer 1 Prt. Nr.: BLM21PG221SN1D
R68 R132 = RES_0402_2.2k_1%: Thick Film Resistors - SMD 2.2kOhm 1%; Manufacturer 1: Vishay / Dale; Manufacturer 1 Prt. Nr.: CRCW04022K20FKEDC; Manufacturer 2 Prt. Nr.: AF0402FR-072K2L; Manufacturer 2: Yageo
R79 = RES_0402_12k_1%: Thick Film Resistors - SMD 12kOhm 1%; Manufacturer 1: Vishay / Dale; Manufacturer 1 Prt. Nr.: CRCW040212K0FKEDC; Manufacturer 2 Prt. Nr.: RC0402FR-7W12KL; Manufacturer 2: Yageo
R80 R85 = RES_0402_10k_1%: Thick Film Resistors - SMD 10kOhm 1%; Manufacturer 1: Vishay / Dale; Manufacturer 1 Prt. Nr.: CRCW040210K0FKEDC; Manufacturer 2 Prt. Nr.: RC0402FR-7W10KL; Manufacturer 2: Yageo
R81 = RES_0402_16k_1%: Thick Film Resistors - SMD 16kOhm 1%; Manufacturer 1: Vishay / Dale; Manufacturer 1 Prt. Nr.: CRCW040216K0FKED; Manufacturer 2 Prt. Nr.: RC0402FR-0716KL; Manufacturer 2: Yageo
R82-R84 = RES_0402_4.7k_1%: as R20-R25 on sheet SFP+_Connectors; Manufacturer 2: Yageo
R86 = RES_0402_12.4k_1%: Thick Film Resistors - SMD 12.4kOhm 1%; Manufacturer 1: Vishay / Dale; Manufacturer 1 Prt. Nr.: CRCW040212K4FKEDC; Manufacturer 2 Prt. Nr.: RC0402FR-0712K4L; Manufacturer 2: Yageo
R254 = RES_0402_5.62k_1%: Thick Film Resistors - SMD 5.62kOhm 1%; Manufacturer 1: Vishay / Dale; Manufacturer 1 Prt. Nr.: CRCW04025K62FKEDC; Manufacturer 2 Prt. Nr.: AC0402FR-7W5K62L; Manufacturer 2: Yageo
TP7 = Testpoint 0.8mm
U6 = TLV62568ADRL_Step Down Converter 1A; 2A: Step Down Converter with Forced PWM in SOT563 Package; Manufacturer 1: Texas Instruments; Manufacturer 1 Prt. Nr.: TLV62568ADRL
U7 = VL822-Q7_USB Interface IC  USB 3.1 Hub 4 Ports: USB Interface IC  USB 3.1 Hub 4 Ports; Manufacturer 1: VIA Labs; Manufacturer 1 Prt. Nr.: VL822-Q7
U8 = AP22811AW5-7_Power Switch ICs - Power Distribution Load Switch: Power Switch ICs - Power Distribution Load Switch; Manufacturer 1: Diodes Incorporated; Manufacturer 1 Prt. Nr.: AP22811AW5-7
U9 U10 = FSUSB42MUX_IC USB SWITCH DPDT: IC USB SWITCH DPDT; Manufacturer 1: onsemi / Fairchild; Manufacturer 1 Prt. Nr.: FSUSB42MUX
Y1 = Quarz 25MHz ESR 50R10pF: 2.5 x 2.0 x 0.55 mm SMD Crystal; Manufacturer 1: ECS; Manufacturer 1 Prt. Nr.: ECS-250-10-36B2-CTN-TR

## Sheet USB-UART-interface.SchDoc
size A3; SheetNumber: 13; SheetTotal: 22
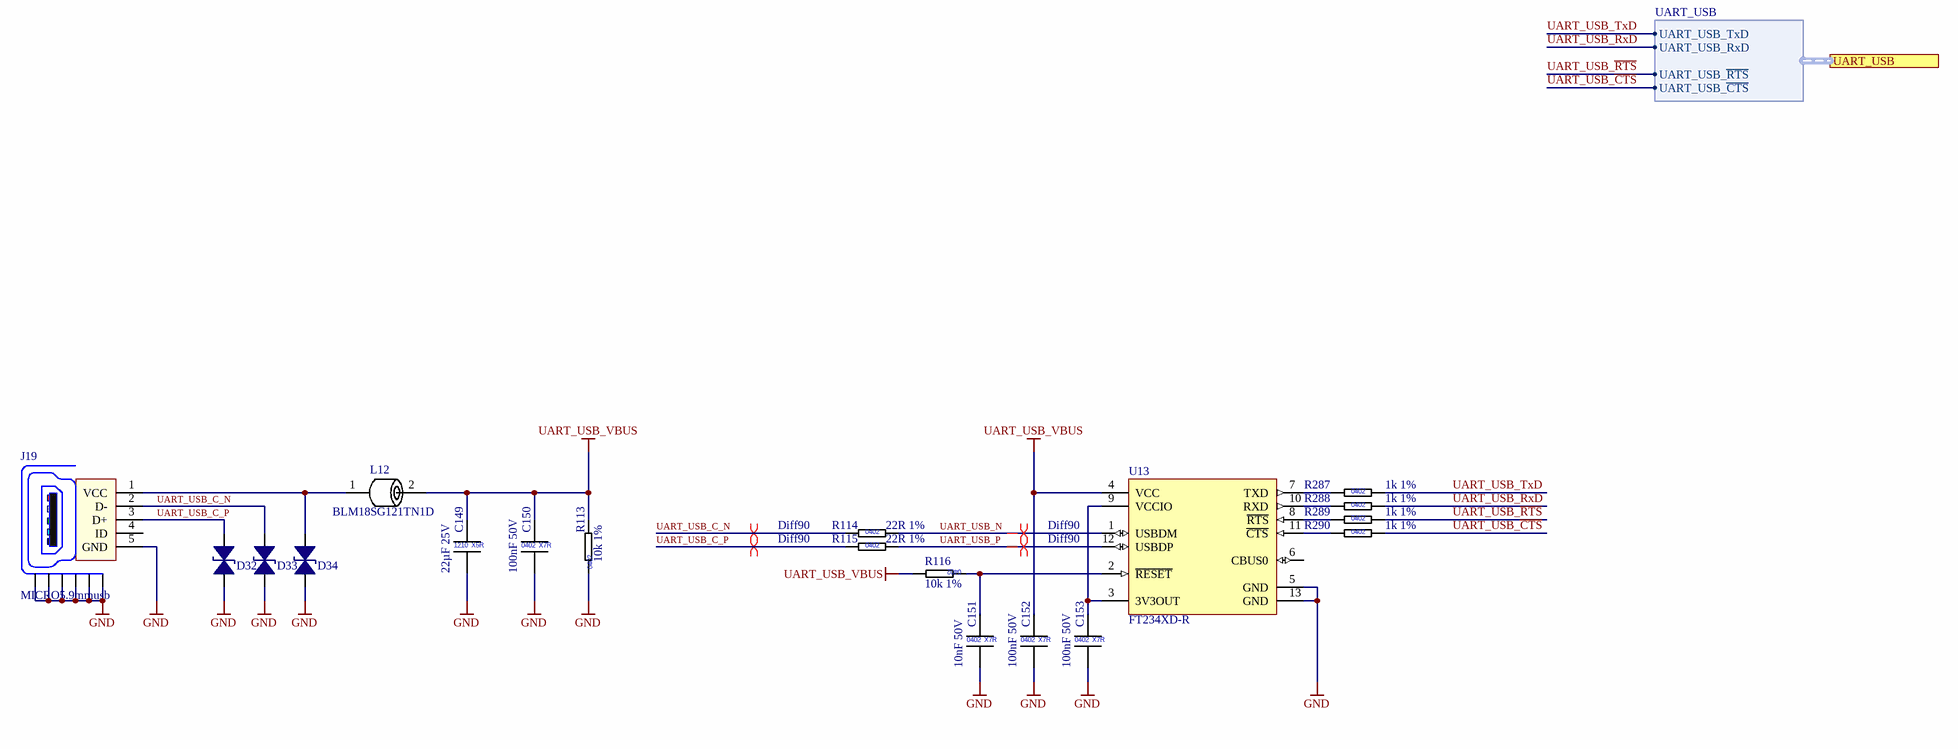
[diagram p14: USB-UART-interface.SchDoc]

### Parts
C149  22µF 25V  [CAP_1210]
C150  100nF 50V  [CAP_0402_L]
C151  10nF 50V  [CAP_0402_L]
C152  100nF 50V  [CAP_0402_L]
C153  100nF 50V  [CAP_0402_L]
D32  CESDP0402UC5VB  [TVS_0402]  (value not drawn)
D33  CESDP0402UC5VB  [TVS_0402]  (value not drawn)
D34  CESDP0402UC5VB  [TVS_0402]  (value not drawn)
J19  MICRO5.9mmusb  [MICRO5.9mmusb]
L12  BLM18SG121TN1D  [L_0603]
R113  10k 1%  [RES_0402_L]
R114  22R 1%  [RES_0402_L]
R115  22R 1%  [RES_0402_L]
R116  10k 1%  [RES_0402_L]
R287  1k 1%  [RES_0402_L]
R288  1k 1%  [RES_0402_L]
R289  1k 1%  [RES_0402_L]
R290  1k 1%  [RES_0402_L]
U13  FT234XD-R  [QFN45P300X300x75_-12N]

### Ports
UART_USB (harness UART_USB, see Top-Level-Sheet[6C], Bank 13_Bank 15_Bank 16[8A])

### Harnesses
UART_USB: UART_USB_TxD, UART_USB_RxD, UART_USB_~{RTS}, UART_USB_~{CTS}

### Nets
GND: C149.2 C150.2 C151.2 C152.2 C153.2 D32.2 D33.2 D34.2 J19.5(GND) J19.6(Shield) J19.7(Shield) J19.8(Shield) J19.9(Shield) J19.10(Shield) J19.11(Shield) R113.1 U13.5(GND) U13.13(GND)
UART_USB_VBUS: C149.1 C150.1 C152.1 L12.2 R113.2 R116.2 U13.4(VCC)
UART_USB_~{CTS}: R290.2 ; port UART_USB.UART_USB_~{CTS}
UART_USB_C_N: D33.1 J19.2(D-) R114.1
UART_USB_C_P: D32.1 J19.3(D+) R115.1
UART_USB_N: R114.2 U13.1(USBDM)
UART_USB_P: R115.2 U13.12(USBDP)
UART_USB_~{RTS}: R289.2 ; port UART_USB.UART_USB_~{RTS}
UART_USB_RxD: R288.2 ; port UART_USB.UART_USB_RxD
UART_USB_TxD: R287.2 ; port UART_USB.UART_USB_TxD
NetC151_1: C151.1 R116.1 U13.2(~{RESET})
NetC153_1: C153.1 U13.3(3V3OUT) U13.9(VCCIO)
NetD34_1: D34.1 J19.1(VCC) L12.1
NetR287_1: R287.1 U13.7(TXD)
NetR288_1: R288.1 U13.10(RXD)
NetR289_1: R289.1 U13.8(~{RTS})
NetR290_1: R290.1 U13.11(~{CTS})

Not connected (* = marked no-connect by the designer): J19 4(ID); U13 6(CBUS0)

### Layout directives
differential pair; net class Diff90: UART_USB_C_N, UART_USB_C_P, UART_USB_N, UART_USB_P

### Notes on the sheet
- Title:
- ++CONFIDENTIAL++
- Date:
- Sheet:
- /
- Time:
- Engineer
- Elektronik- und Softwareentwicklung aus Nürnberg
- The  information  contained  in  these  documents  is  confidential,  privileged  and  only  for  the
  information of the intended recipient and may
  not be used, published or redistributed without
  the prior written consent from PCB Arts GmbH.
- Revision:
- Checked:
- https://pcb-arts.com/
- mail@pcb-arts.com
- (in symbol CAP_0402_10nF_50V) 0402; X7R
- (in symbol CAP_0402_100nF_50V) 0402; X7R
- (in symbol CAP_1210_22µF_25V) 1210; X5R
- (in symbol RES_0402_1k_1%) 0402
- (in symbol RES_0402_10k_1%) 0402
- (in symbol RES_0402_22R_1%) 0402

### Library data of the parts
C149 = CAP_1210_22µF_25V: as C87 on sheet SFP+_Connectors; Manufacturer 2: Taiyo Yuden
C150 C152 C153 = CAP_0402_100nF_50V: as C105 on sheet Raspberry Pi CM4; Manufacturer 2: TDK
C151 = CAP_0402_10nF_50V: Multilayer Ceramic Capacitors MLCC - SMD/SMT 0402 50VDC; Manufacturer 1: Wurth Elektronik; Manufacturer 1 Prt. Nr.: 885012205067; Manufacturer 2 Prt. Nr.: AC0402KPX7R9BB103; Manufacturer 2: Yageo
D32-D34 = CESDP0402UC5VB_TVS Diode 0402: as D22-D28 on sheet USB-HUB-MUX; Manufacturer 1 Prt. Nr.: CESDP0402UC5VB; Manufacturer 2: BORN
J19 = SMD micro USB Connector Horizontal C393940: SHOU HAN  MICRO5.9mmusb; Manufacturer 1: SHOU HAN; Manufacturer 1 Prt. Nr.: MICRO5.9mmusb
L12 = BLM18SG121TN1D_Ferrite Beads 0603 120Ohms 3000mA: as L1-L8 on sheet SFP+_Connectors; Manufacturer 1 Prt. Nr.: BLM18SG121TN1D
R113 R116 = RES_0402_10k_1%: as R80 on sheet USB-HUB-MUX; Manufacturer 2: Yageo
R114 R115 = RES_0402_22R_1%: Thick Film Resistors - SMD 22Ohm 1%; Manufacturer 1: Vishay / Dale; Manufacturer 1 Prt. Nr.: CRCW040222R0FKEDC; Manufacturer 2 Prt. Nr.: RC0402FR-7W22RL; Manufacturer 2: Yageo
R287-R290 = RES_0402_1k_1%: as R71 on sheet Raspberry Pi CM4; Manufacturer 2: Yageo
U13 = FT234XD-R_IC USB SERIAL BASIC UART 12DFN: IC USB SERIAL BASIC UART 12DFN; Manufacturer 1: FTDI; Manufacturer 1 Prt. Nr.: FT234XD-R